# EAGLE schematic Orbit I_AnalougeEngine_V2_0 (EAGLE 9.1.0)

## Sheet 1 of 11: Interface
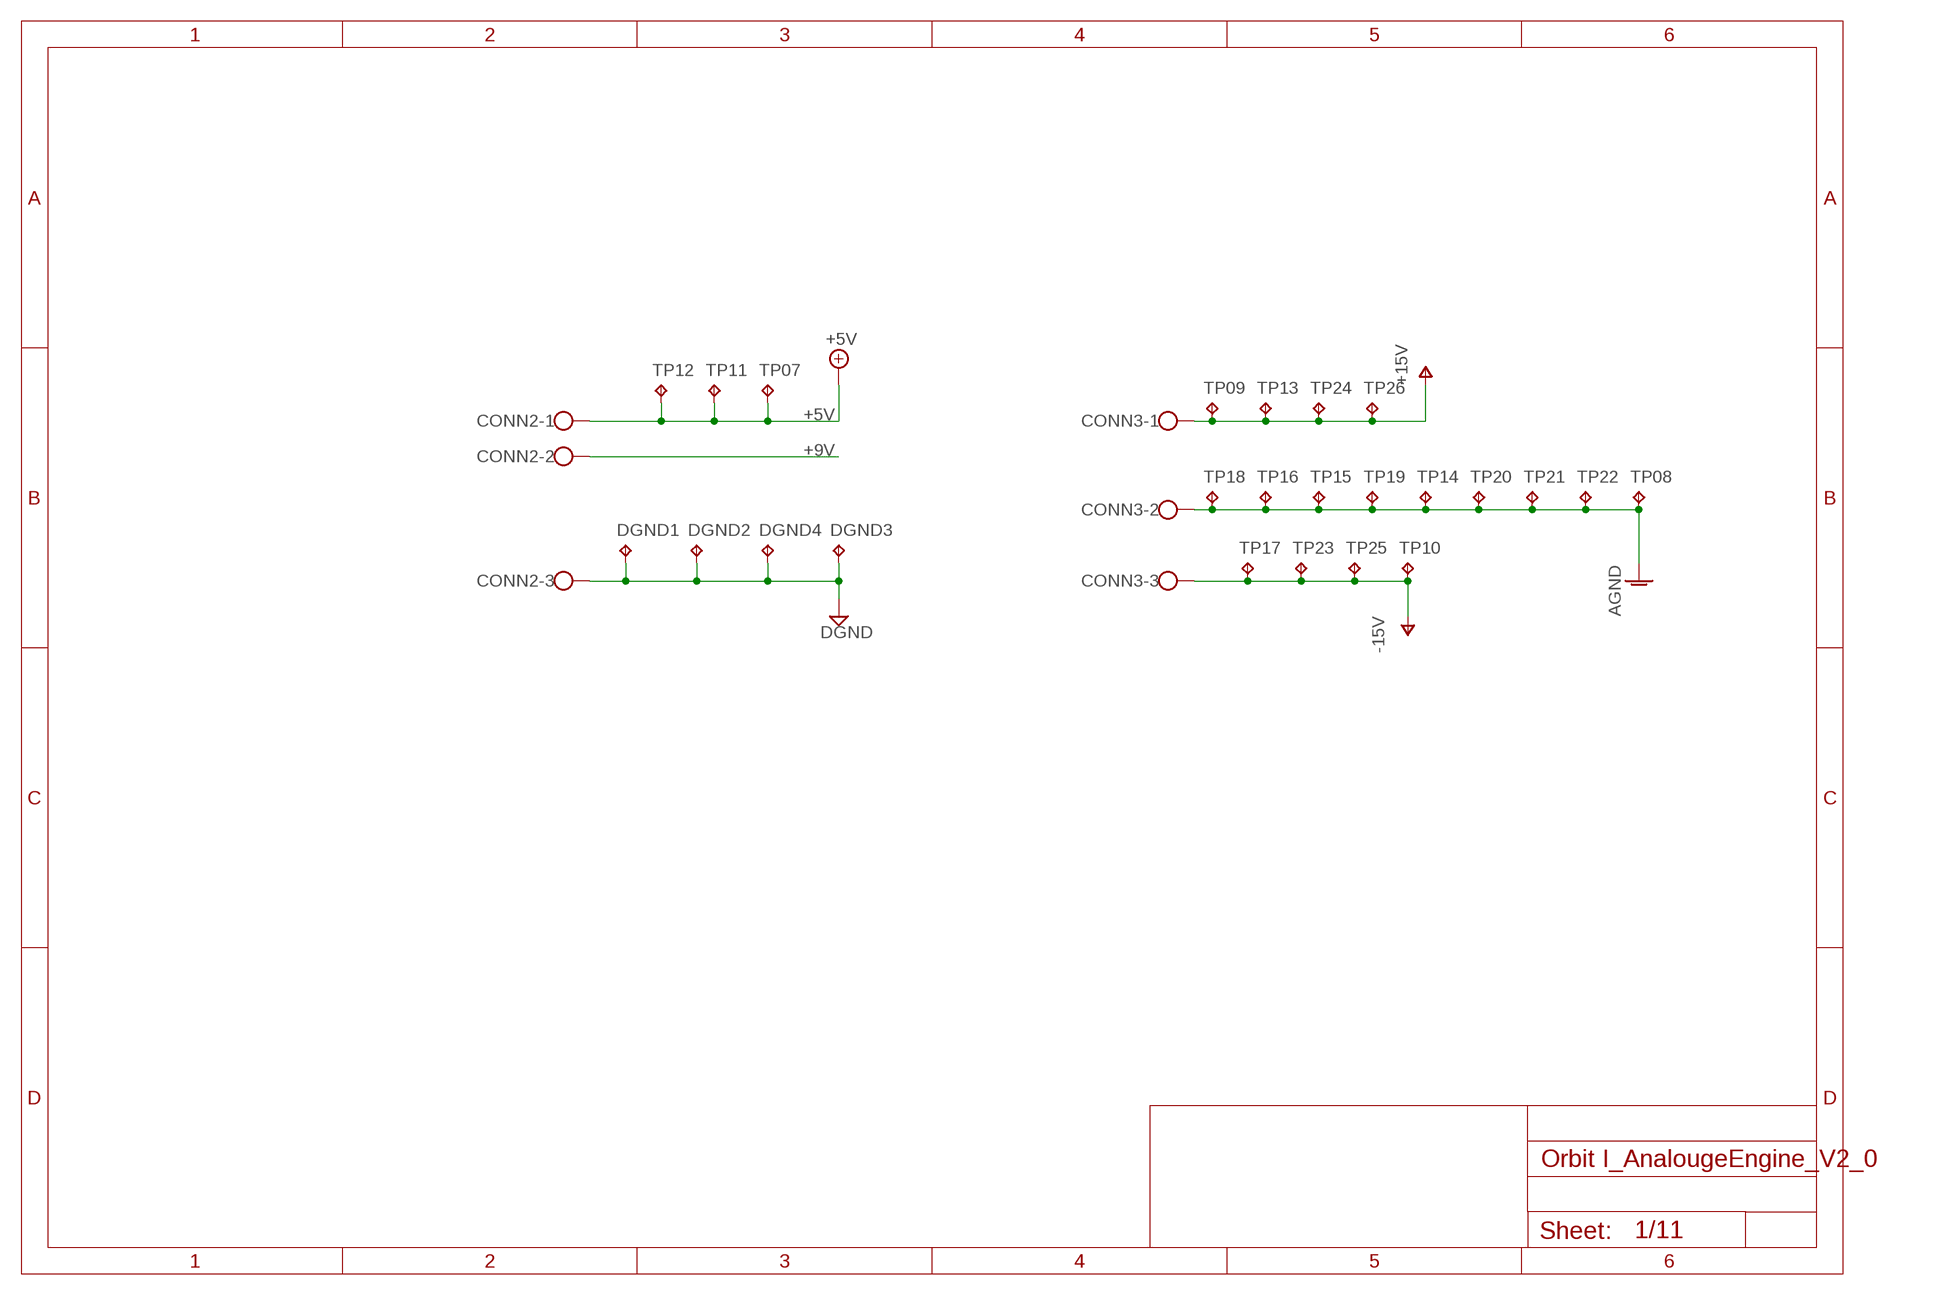
[diagram p0: schematic, sheet 1]

### Parts
CONN2  SCHRAUBKLEMME_3POL  [W237-103]
CONN3  SCHRAUBKLEMME_3POL  [W237-103]
DGND1  TPTHT  [THT_PIN]
DGND2  TPTHT  [THT_PIN]
DGND3  TPTHT  [THT_PIN]
DGND4  TPTHT  [THT_PIN]
TP07  TPTHT  [THT_PIN]
TP08  TPTHT  [THT_PIN]
TP09  TPTHT  [THT_PIN]
TP10  TPTHT  [THT_PIN]
TP11  TPTHT  [THT_PIN]
TP12  TPTHT  [THT_PIN]
TP13  TPTHT  [THT_PIN]
TP14  TPTHT  [THT_PIN]
TP15  TPTHT  [THT_PIN]
TP16  TPTHT  [THT_PIN]
TP17  TPTHT  [THT_PIN]
TP18  TPTHT  [THT_PIN]
TP19  TPTHT  [THT_PIN]
TP20  TPTHT  [THT_PIN]
TP21  TPTHT  [THT_PIN]
TP22  TPTHT  [THT_PIN]
TP23  TPTHT  [THT_PIN]
TP24  TPTHT  [THT_PIN]
TP25  TPTHT  [THT_PIN]
TP26  TPTHT  [THT_PIN]

### Nets
+5V: CONN2.1 TP07.P$1(TP) TP11.P$1(TP) TP12.P$1(TP) ; also sheet 2,8,9,10
+9V: CONN2.2
AGND: CONN3.2 TP08.P$1(TP) TP14.P$1(TP) TP15.P$1(TP) TP16.P$1(TP) TP18.P$1(TP) TP19.P$1(TP) TP20.P$1(TP) TP21.P$1(TP) TP22.P$1(TP) ; also sheet 3,4,5,6,7,8,11
DGND: CONN2.3 DGND1.P$1(TP) DGND2.P$1(TP) DGND3.P$1(TP) DGND4.P$1(TP) ; also sheet 2,8,9,10
V+: CONN3.1 TP09.P$1(TP) TP13.P$1(TP) TP24.P$1(TP) TP26.P$1(TP) ; supply symbol labelled +15V ; also sheet 3,4,5,6,7,8,11
V-: CONN3.3 TP10.P$1(TP) TP17.P$1(TP) TP23.P$1(TP) TP25.P$1(TP) ; supply symbol labelled -15V ; also sheet 3,4,5,6,7,11

## Sheet 2 of 11: Relais
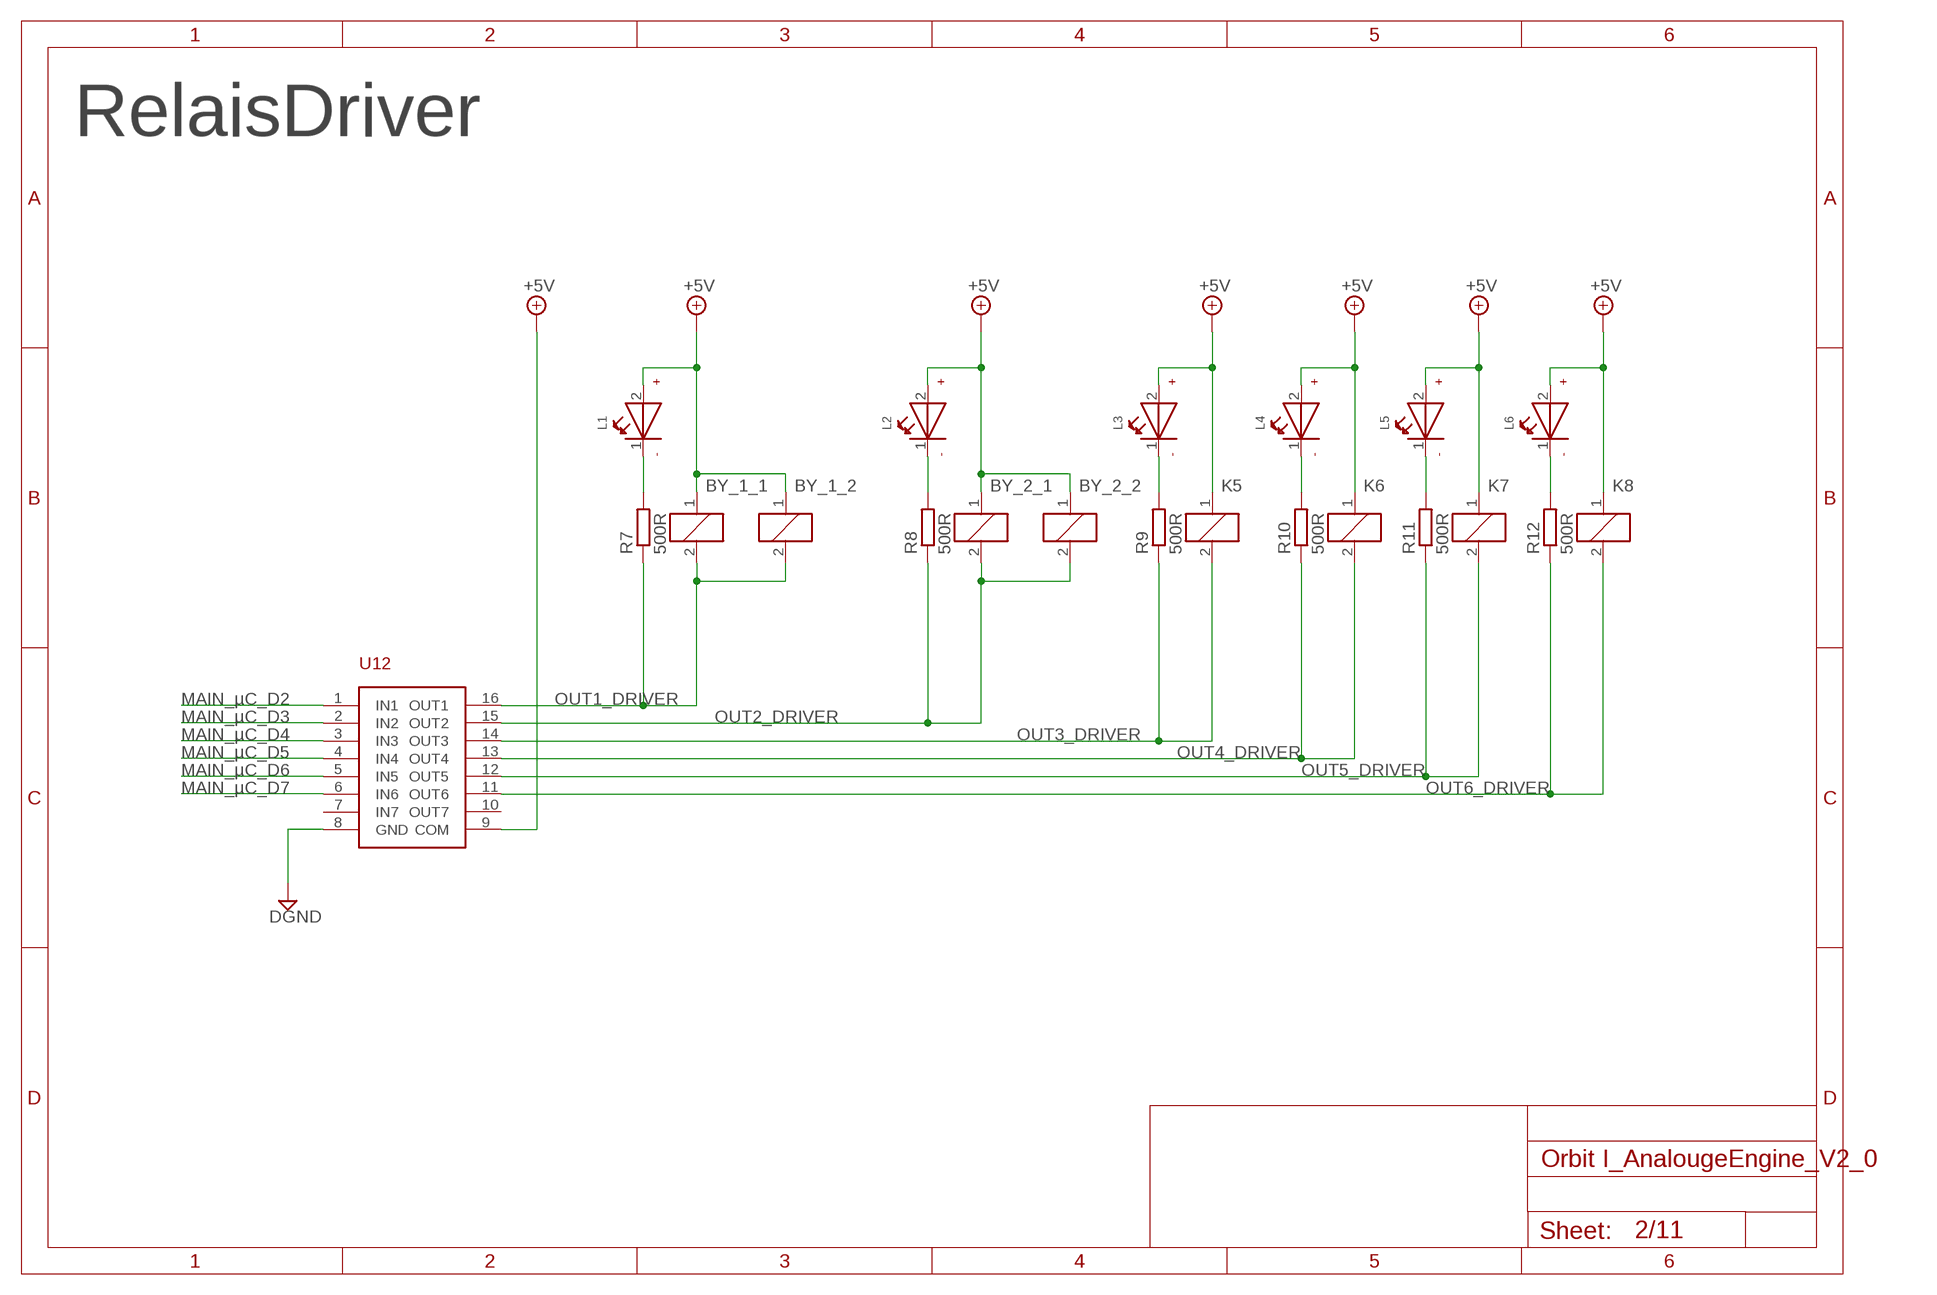
[diagram p1: schematic, sheet 2]

### Parts
BY_1_1  RELAY_EE2-5NU  [351]
BY_1_2  RELAY_EE2-5NU  [351]
BY_2_1  RELAY_EE2-5NU  [351]
BY_2_2  RELAY_EE2-5NU  [351]
K5  RELAY_EE2-5NU  [351]
K6  RELAY_EE2-5NU  [351]
K7  RELAY_EE2-5NU  [351]
K8  RELAY_EE2-5NU  [351]
L1  SMD_LED_0603  [WL-SMCW_0603]
L2  SMD_LED_0603  [WL-SMCW_0603]
L3  SMD_LED_0603  [WL-SMCW_0603]
L4  SMD_LED_0603  [WL-SMCW_0603]
L5  SMD_LED_0603  [WL-SMCW_0603]
L6  SMD_LED_0603  [WL-SMCW_0603]
R7  500R  RESISTOR"  [R0805]
R8  500R  RESISTOR"  [R0805]
R9  500R  RESISTOR"  [R0805]
R10  500R  RESISTOR"  [R0805]
R11  500R  RESISTOR"  [R0805]
R12  500R  RESISTOR"  [R0805]
U12  ULN2003  [SOIC16]

### Nets
+5V: BY_1_1.1 BY_1_2.1 BY_2_1.1 BY_2_2.1 K5.1 K6.1 K7.1 K8.1 L1.2(+) L2.2(+) L3.2(+) L4.2(+) L5.2(+) L6.2(+) U12.9(COM) ; also sheet 1,8,9,10
DGND: U12.8(GND) ; also sheet 1,8,9,10
MAIN_µC_D2: U12.1(IN1) ; also sheet 10
MAIN_µC_D3: U12.2(IN2) ; also sheet 10
MAIN_µC_D4: U12.3(IN3) ; also sheet 10
MAIN_µC_D5: U12.4(IN4) ; also sheet 10
MAIN_µC_D6: U12.5(IN5) ; also sheet 10
MAIN_µC_D7: U12.6(IN6) ; also sheet 10
N$14: L1.1(-) R7.2
N$16: L2.1(-) R8.2
N$26: L6.1(-) R12.2
N$29: L5.1(-) R11.2
N$30: L4.1(-) R10.2
N$32: L3.1(-) R9.2
OUT1_DRIVER: BY_1_1.2 BY_1_2.2 R7.1 U12.16(OUT1)
OUT2_DRIVER: BY_2_1.2 BY_2_2.2 R8.1 U12.15(OUT2)
OUT3_DRIVER: K5.2 R9.1 U12.14(OUT3)
OUT4_DRIVER: K6.2 R10.1 U12.13(OUT4)
OUT5_DRIVER: K7.2 R11.1 U12.12(OUT5)
OUT6_DRIVER: K8.2 R12.1 U12.11(OUT6)
Unconnected: U12.7(IN7) U12.10(OUT7)

### Notes on the sheet
- RelaisDriver

## Sheet 3 of 11: Right I/O Section
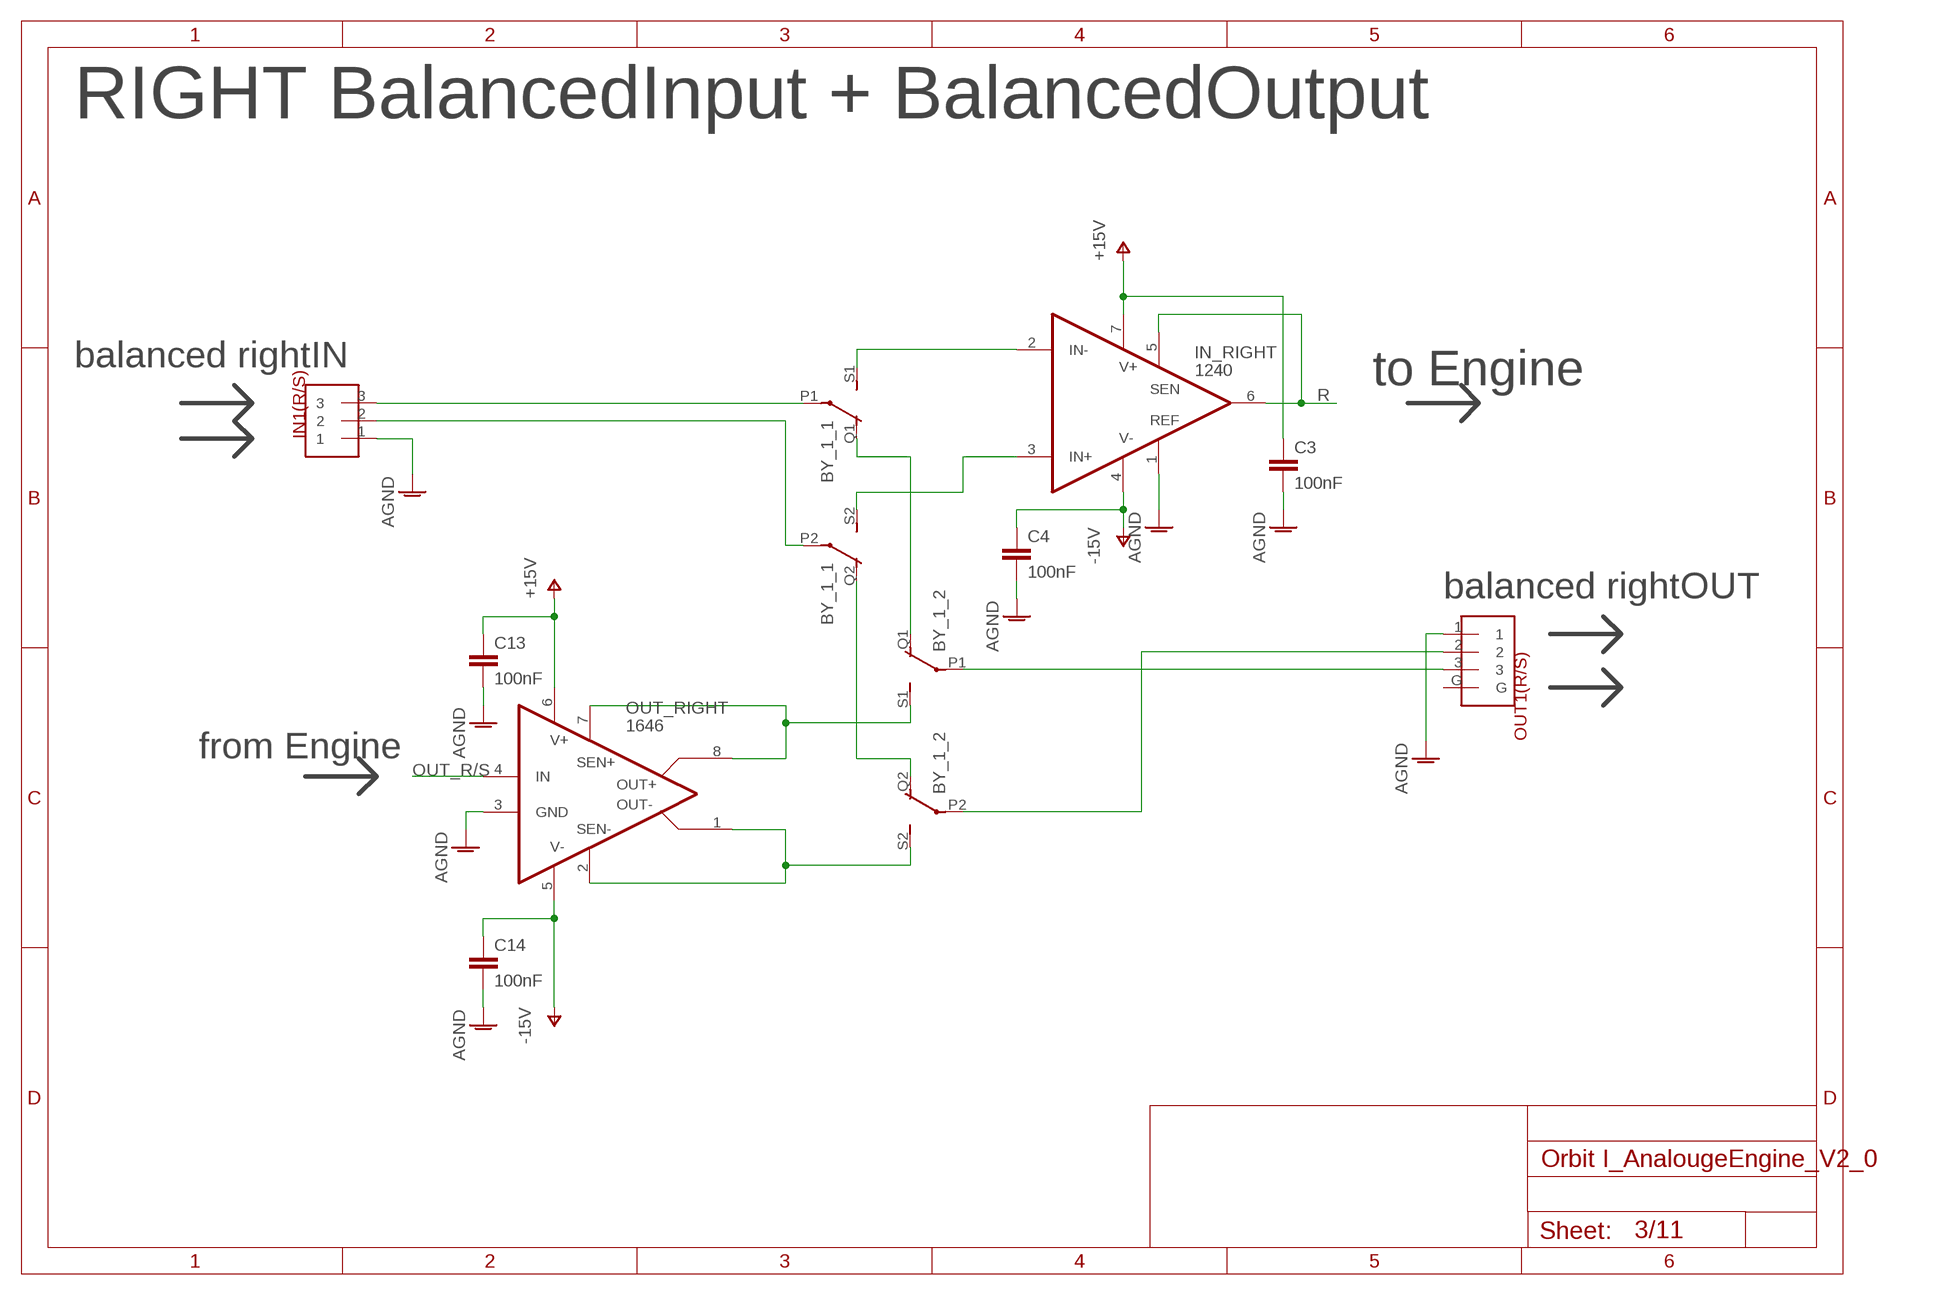
[diagram p2: schematic, sheet 3]

### Parts
C3  100nF  CAPACITOR"  [C0603]
C4  100nF  CAPACITOR"  [C0603]
C13  100nF  CAPACITOR"  [C0603]
C14  100nF  CAPACITOR"  [C0603]
IN1(R/S)  NEUTRIK_NC3FAH  [NEUTRIK_NC3FAH]
IN_RIGHT  1240  THAT1240SO8-U  [SO08]
OUT1(R/S)  NEUTRIK_NC3MAH  [NEUTRIK_NC3MAH]
OUT_RIGHT  1646  THAT1646SO8-U  [SO08]

### Nets
AGND: C3.2 C4.2 C13.2 C14.2 IN1(R/S).1 IN_RIGHT.1(REF) OUT1(R/S).1 OUT_RIGHT.3(GND) ; also sheet 1,4,5,6,7,8,11
N$1: BY_1_1.S1(2:S) IN_RIGHT.2(IN-)
N$2: BY_1_1.S2(3:S) IN_RIGHT.3(IN+)
N$8: BY_1_1.Q1(2:O) BY_1_2.Q1(2:O)
N$11: BY_1_1.Q2(3:O) BY_1_2.Q2(3:O)
N$21: BY_1_1.P2(3:P) IN1(R/S).2
N$22: BY_1_1.P1(2:P) IN1(R/S).3
N$23: BY_1_2.P2(3:P) OUT1(R/S).2
N$24: BY_1_2.P1(2:P) OUT1(R/S).3
OUT_R/S: OUT_RIGHT.4(IN) ; also sheet 7
R: IN_RIGHT.5(SEN) IN_RIGHT.6(OUT) ; also sheet 5,11
R/S_OUT+: BY_1_2.S1(2:S) OUT_RIGHT.7(SEN+) OUT_RIGHT.8(OUT+)
R/S_OUT-: BY_1_2.S2(3:S) OUT_RIGHT.1(OUT-) OUT_RIGHT.2(SEN-)
V+: C3.1 C13.1 IN_RIGHT.7(V+) OUT_RIGHT.6(V+) ; supply symbol labelled +15V ; also sheet 1,4,5,6,7,8,11
V-: C4.1 C14.1 IN_RIGHT.4(V-) OUT_RIGHT.5(V-) ; supply symbol labelled -15V ; also sheet 1,4,5,6,7,11
Unconnected: OUT1(R/S).G

### Notes on the sheet
- RIGHT BalancedInput + BalancedOutput
- balanced rightIN
- to Engine
- balanced rightOUT
- from Engine

## Sheet 4 of 11: Left I/O Section
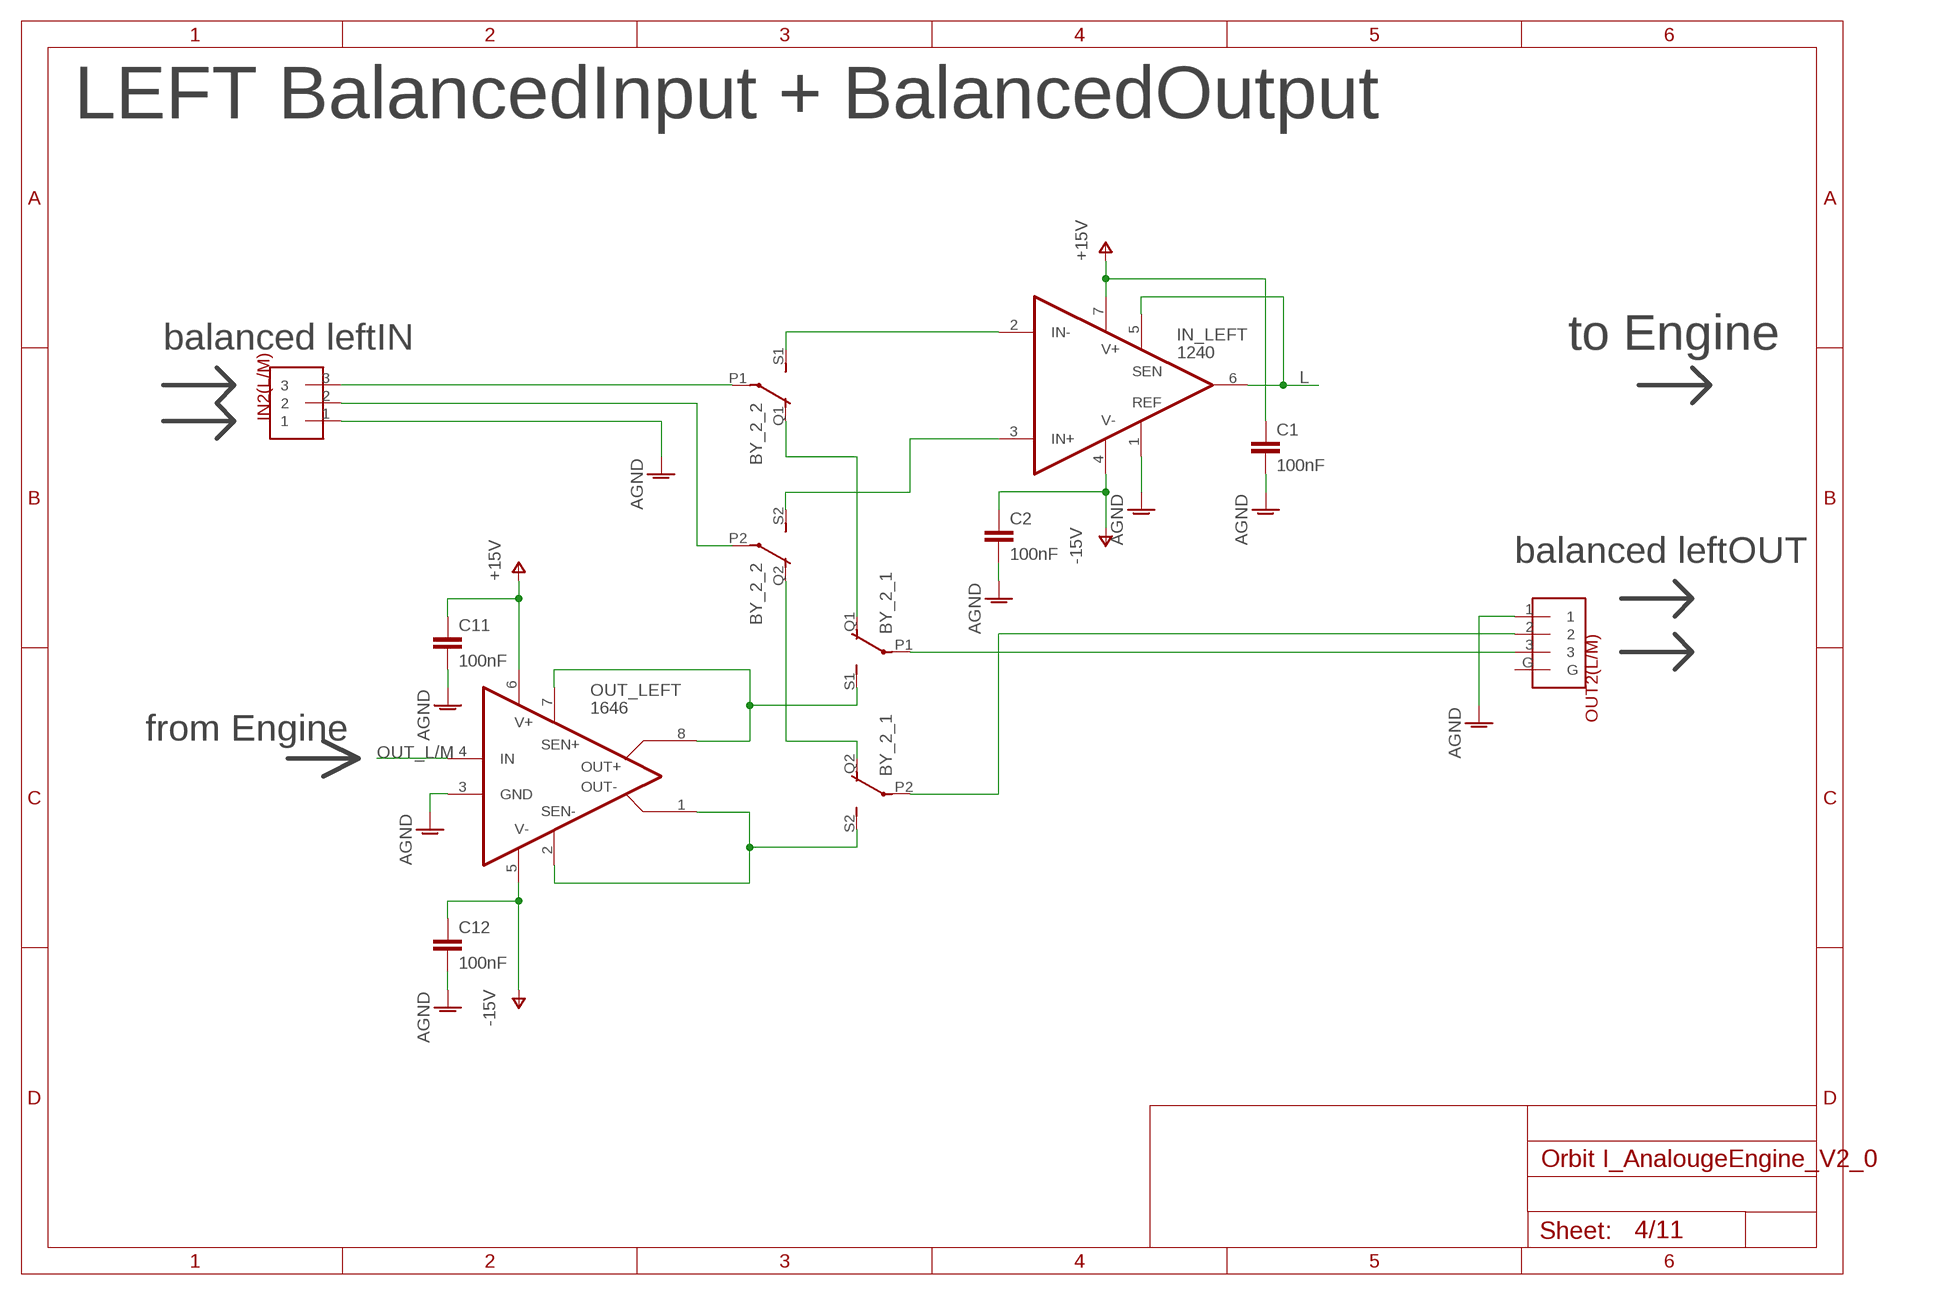
[diagram p3: schematic, sheet 4]

### Parts
C1  100nF  CAPACITOR"  [C0603]
C2  100nF  CAPACITOR"  [C0603]
C11  100nF  CAPACITOR"  [C0603]
C12  100nF  CAPACITOR"  [C0603]
IN2(L/M)  NEUTRIK_NC3FAH  [NEUTRIK_NC3FAH]
IN_LEFT  1240  THAT1240SO8-U  [SO08]
OUT2(L/M)  NEUTRIK_NC3MAH  [NEUTRIK_NC3MAH]
OUT_LEFT  1646  THAT1646SO8-U  [SO08]

### Nets
AGND: C1.2 C2.2 C11.2 C12.2 IN2(L/M).1 IN_LEFT.1(REF) OUT2(L/M).1 OUT_LEFT.3(GND) ; also sheet 1,3,5,6,7,8,11
L: IN_LEFT.5(SEN) IN_LEFT.6(OUT) ; also sheet 5,11
L/M_OUT+: BY_2_1.S1(2:S) OUT_LEFT.7(SEN+) OUT_LEFT.8(OUT+)
L/M_OUT-: BY_2_1.S2(3:S) OUT_LEFT.1(OUT-) OUT_LEFT.2(SEN-)
N$7: BY_2_2.S2(3:S) IN_LEFT.3(IN+)
N$13: BY_2_2.S1(2:S) IN_LEFT.2(IN-)
N$15: BY_2_1.P1(2:P) OUT2(L/M).3
N$17: BY_2_1.P2(3:P) OUT2(L/M).2
N$25: BY_2_2.P1(2:P) IN2(L/M).3
N$27: BY_2_2.P2(3:P) IN2(L/M).2
N$28: BY_2_1.Q1(2:O) BY_2_2.Q1(2:O)
N$31: BY_2_1.Q2(3:O) BY_2_2.Q2(3:O)
OUT_L/M: OUT_LEFT.4(IN) ; also sheet 7
V+: C1.1 C11.1 IN_LEFT.7(V+) OUT_LEFT.6(V+) ; supply symbol labelled +15V ; also sheet 1,3,5,6,7,8,11
V-: C2.1 C12.1 IN_LEFT.4(V-) OUT_LEFT.5(V-) ; supply symbol labelled -15V ; also sheet 1,3,5,6,7,11
Unconnected: OUT2(L/M).G

### Notes on the sheet
- LEFT BalancedInput + BalancedOutput
- balanced leftIN | to Engine
- balanced leftOUT
- from Engine

## Sheet 5 of 11: MS Encode
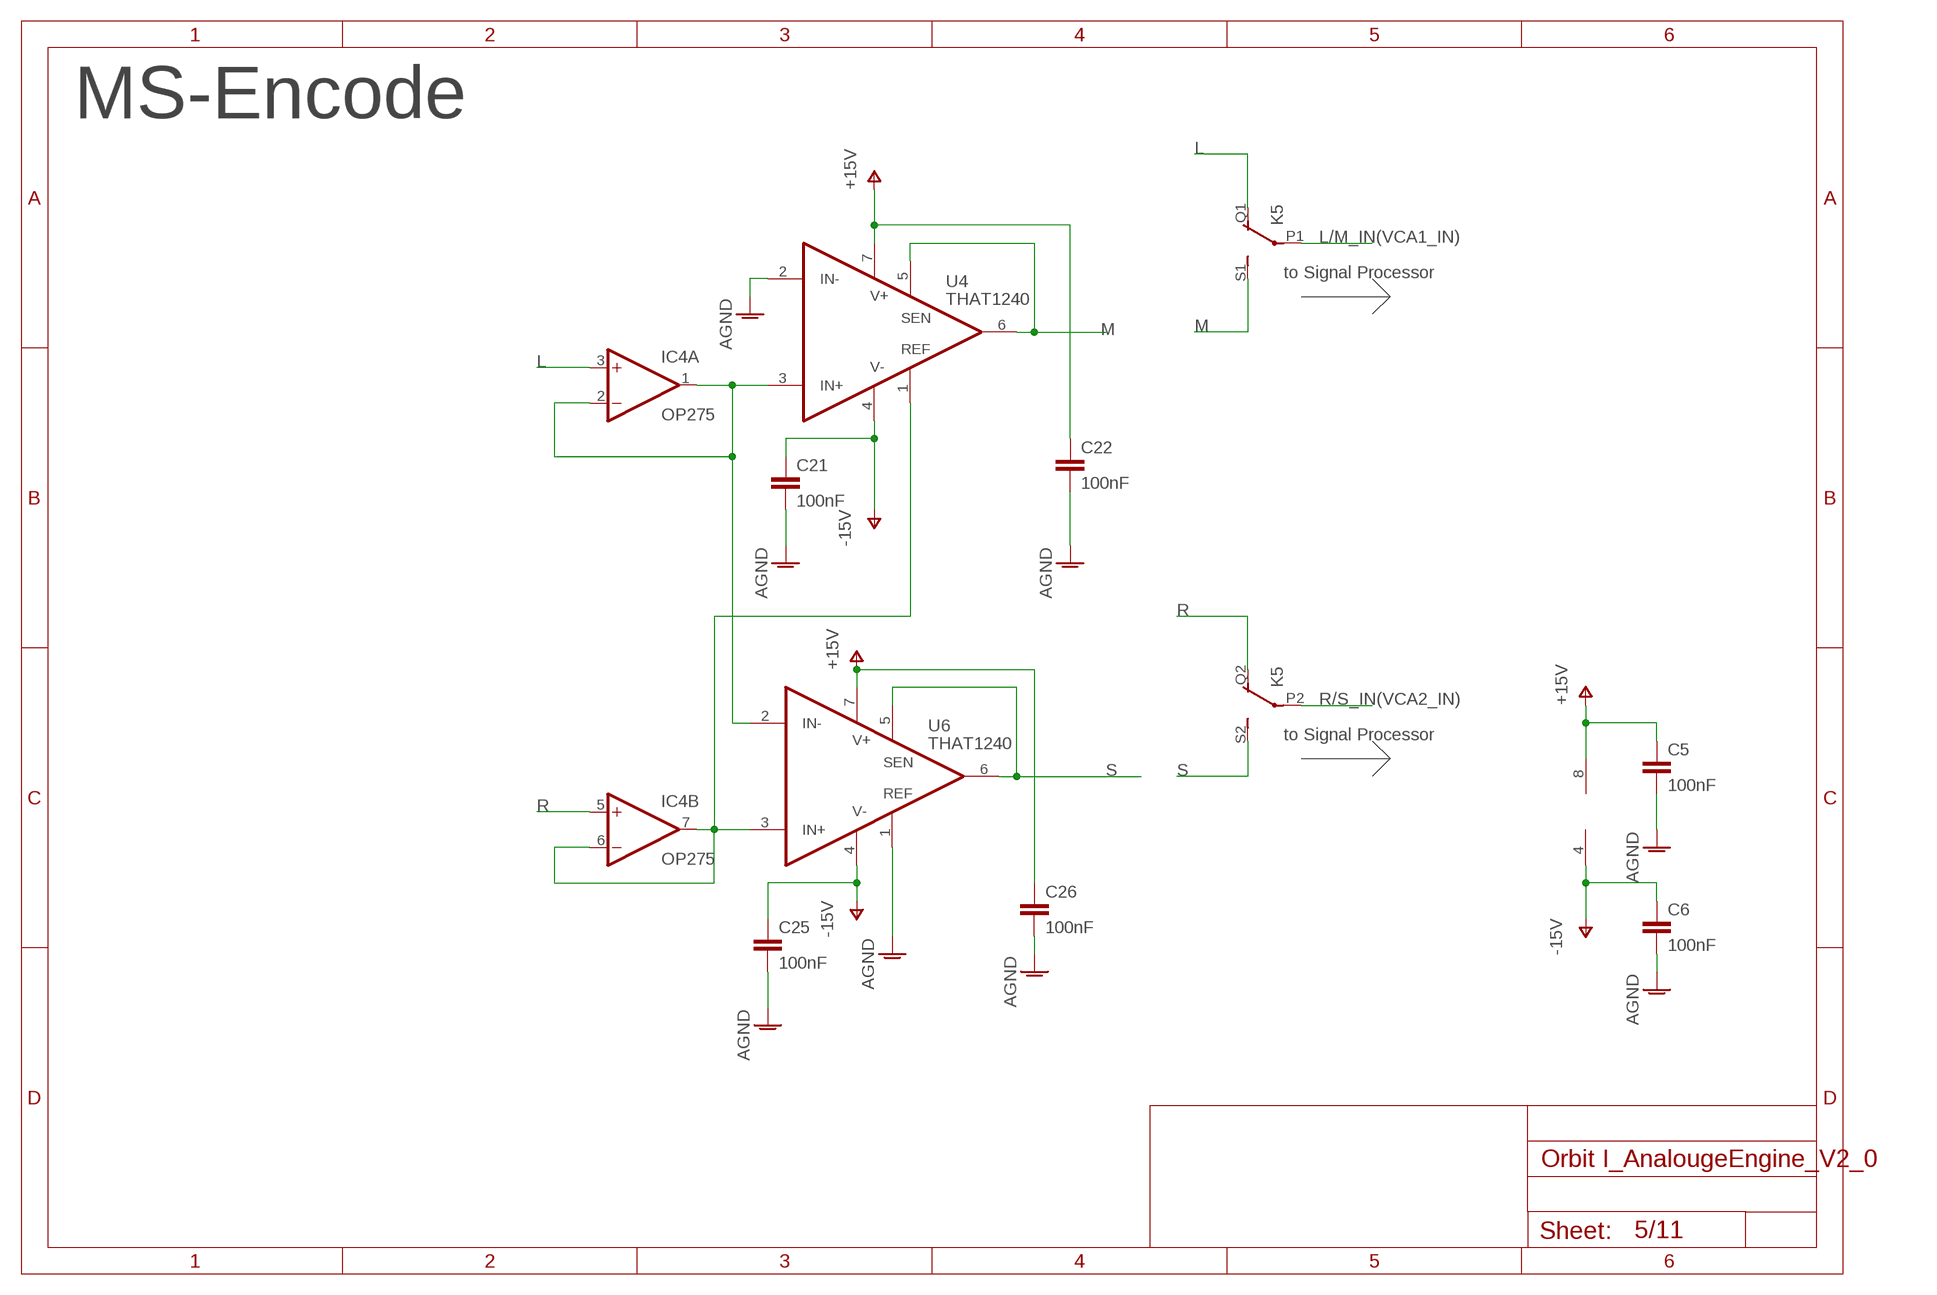
[diagram p4: schematic, sheet 5]

### Parts
C5  100nF  CAPACITOR"  [C0603]
C6  100nF  CAPACITOR"  [C0603]
C21  100nF  CAPACITOR"  [C0603]
C22  100nF  CAPACITOR"  [C0603]
C25  100nF  CAPACITOR"  [C0603]
C26  100nF  CAPACITOR"  [C0603]
IC4  OP275  [SOIC8]
U4  THAT1240  THAT1240SO8-U  [SO08]
U6  THAT1240  THAT1240SO8-U  [SO08]

### Nets
AGND: C5.2 C6.2 C21.2 C22.2 C25.2 C26.2 U4.2(IN-) U6.1(REF) ; also sheet 1,3,4,6,7,8,11
L: IC4.3(A:+IN) K5.Q1(2:O) ; also sheet 4,11
L/M_IN(VCA1_IN): K5.P1(2:P) ; also sheet 6
M: K5.S1(2:S) U4.5(SEN) U4.6(OUT) ; also sheet 11
N$18: IC4.1(A:OUT) IC4.2(A:-IN) U4.3(IN+) U6.2(IN-)
N$33: IC4.6(B:-IN) IC4.7(B:OUT) U4.1(REF) U6.3(IN+)
R: IC4.5(B:+IN) K5.Q2(3:O) ; also sheet 3,11
R/S_IN(VCA2_IN): K5.P2(3:P) ; also sheet 6
S: K5.S2(3:S) U6.5(SEN) U6.6(OUT) ; also sheet 11
V+: C5.1 C22.1 C26.1 IC4.8(P:V+) U4.7(V+) U6.7(V+) ; supply symbol labelled +15V ; also sheet 1,3,4,6,7,8,11
V-: C6.1 C21.1 C25.1 IC4.4(P:V-) U4.4(V-) U6.4(V-) ; supply symbol labelled -15V ; also sheet 1,3,4,6,7,11

### Notes on the sheet
- MS-Encode
- to Signal Processor
- to Signal Processor

## Sheet 6 of 11: VCA
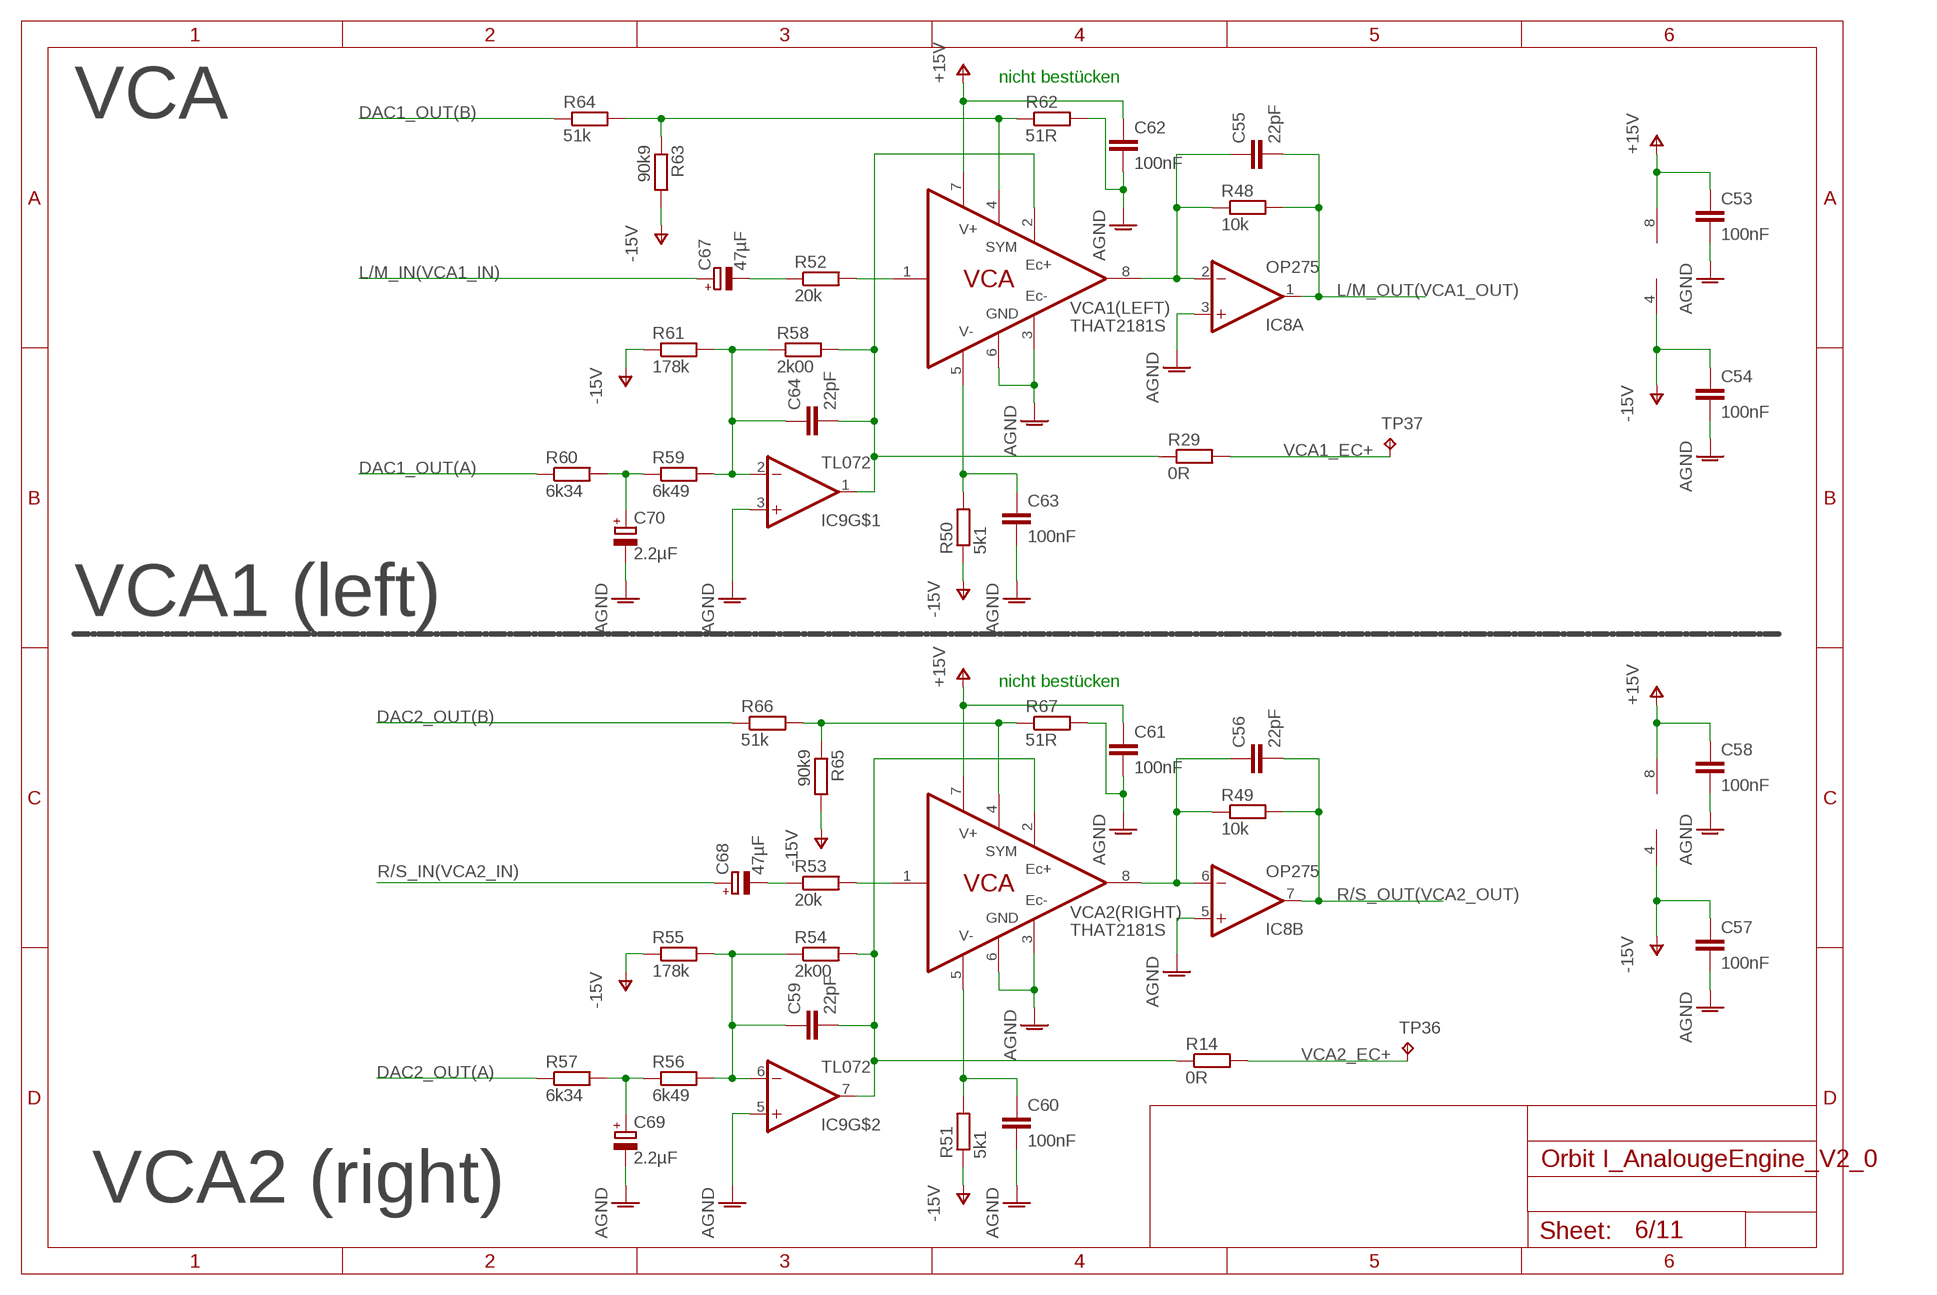
[diagram p5: schematic, sheet 6]

### Parts
C53  100nF  CAPACITOR"  [C0603]
C54  100nF  CAPACITOR"  [C0603]
C55  22pF  CAPACITOR"  [C0603]
C56  22pF  CAPACITOR"  [C0603]
C57  100nF  CAPACITOR"  [C0603]
C58  100nF  CAPACITOR"  [C0603]
C59  22pF  CAPACITOR"  [C0603]
C60  100nF  CAPACITOR"  [C0603]
C61  100nF  CAPACITOR"  [C0603]
C62  100nF  CAPACITOR"  [C0603]
C63  100nF  CAPACITOR"  [C0603]
C64  22pF  CAPACITOR"  [C0603]
C67  47µF  SMD_ELCTROLYTIC  [153CLV-0605]
C68  47µF  SMD_ELCTROLYTIC  [153CLV-0605]
C69  2.2µF  SMD_ELCTROLYTIC  [153CLV-0605]
C70  2.2µF  SMD_ELCTROLYTIC  [153CLV-0605]
IC8  OP275  [SOIC8]
IC9  TL072  [SOIC8]
R14  0R  RESISTOR"  [R0805]
R29  0R  RESISTOR"  [R0805]
R48  10k  RESISTOR"  [R0805]
R49  10k  RESISTOR"  [R0805]
R50  5k1  RESISTOR"  [R0805]
R51  5k1  RESISTOR"  [R0805]
R52  20k  RESISTOR"  [R0805]
R53  20k  RESISTOR"  [R0805]
R54  2k00  RESISTOR"  [R0805]
R55  178k  RESISTOR"  [R0805]
R56  6k49  RESISTOR"  [R0805]
R57  6k34  RESISTOR"  [R0805]
R58  2k00  RESISTOR"  [R0805]
R59  6k49  RESISTOR"  [R0805]
R60  6k34  RESISTOR"  [R0805]
R61  178k  RESISTOR"  [R0805]
R62  51R  RESISTOR"  [R0805]
R63  90k9  RESISTOR"  [R0805]
R64  51k  RESISTOR"  [R0805]
R65  90k9  RESISTOR"  [R0805]
R66  51k  RESISTOR"  [R0805]
R67  51R  RESISTOR"  [R0805]
TP36  TPTHT  [THT_PIN]
TP37  TPTHT  [THT_PIN]
VCA1(LEFT)  THAT2181S  [SO08]
VCA2(RIGHT)  THAT2181S  [SO08]

### Nets
AGND: C53.2 C54.2 C57.2 C58.2 C60.2 C61.2 C62.2 C63.2 C69.- C70.- IC8.3(A:+IN) IC8.5(B:+IN) IC9.3(+IN) IC9.5(+IN) R62.2 R67.2 VCA1(LEFT).3(EC-) VCA1(LEFT).6(GND) VCA2(RIGHT).3(EC-) VCA2(RIGHT).6(GND) ; also sheet 1,3,4,5,7,8,11
DAC1_OUT(A): R60.1 ; also sheet 8
DAC1_OUT(B): R64.1 ; also sheet 8
DAC2_OUT(A): R57.1 ; also sheet 8
DAC2_OUT(B): R66.1 ; also sheet 8
L/M_IN(VCA1_IN): C67.+ ; also sheet 5
L/M_OUT(VCA1_OUT): C55.2 IC8.1(A:OUT) R48.2 ; also sheet 7,11
N$64: C55.1 IC8.2(A:-IN) R48.1 VCA1(LEFT).8(OUT)
N$65: R52.2 VCA1(LEFT).1(IN)
N$71: C67.- R52.1
N$72: C70.+ R59.1 R60.2
N$75: C56.1 IC8.6(B:-IN) R49.1 VCA2(RIGHT).8(OUT)
N$77: C60.1 R51.2 VCA2(RIGHT).5(V-)
N$78: C68.- R53.1
N$79: R53.2 VCA2(RIGHT).1(IN)
N$80: C63.1 R50.2 VCA1(LEFT).5(V-)
N$81: C59.1 IC9.6(-IN) R54.1 R55.2 R56.2
N$82: C59.2 IC9.7(OUT) R14.1 R54.2 VCA2(RIGHT).2(EC+)
N$84: C64.1 IC9.2(-IN) R58.1 R59.2 R61.2
N$85: C69.+ R56.1 R57.2
N$87: R62.1 R63.1 R64.2 VCA1(LEFT).4(SYM)
N$88: C64.2 IC9.1(OUT) R29.1 R58.2 VCA1(LEFT).2(EC+)
N$95: R65.1 R66.2 R67.1 VCA2(RIGHT).4(SYM)
R/S_IN(VCA2_IN): C68.+ ; also sheet 5
R/S_OUT(VCA2_OUT): C56.2 IC8.7(B:OUT) R49.2 ; also sheet 7,11
V+: C53.1 C58.1 C61.1 C62.1 IC8.8(P:V+) IC9.8(V+) VCA1(LEFT).7(V+) VCA2(RIGHT).7(V+) ; supply symbol labelled +15V ; also sheet 1,3,4,5,7,8,11
V-: C54.1 C57.1 IC8.4(P:V-) IC9.4(V-) R50.1 R51.1 R55.1 R61.1 R63.2 R65.2 ; supply symbol labelled -15V ; also sheet 1,3,4,5,7,11
VCA1_EC+: R29.2 TP37.P$1(TP) ; also sheet 10
VCA2_EC+: R14.2 TP36.P$1(TP) ; also sheet 10

### Notes on the sheet
- nicht bestücken
- VCA
- VCA1 (left)
- nicht bestücken
- VCA2 (right)

## Sheet 7 of 11: MS Decode
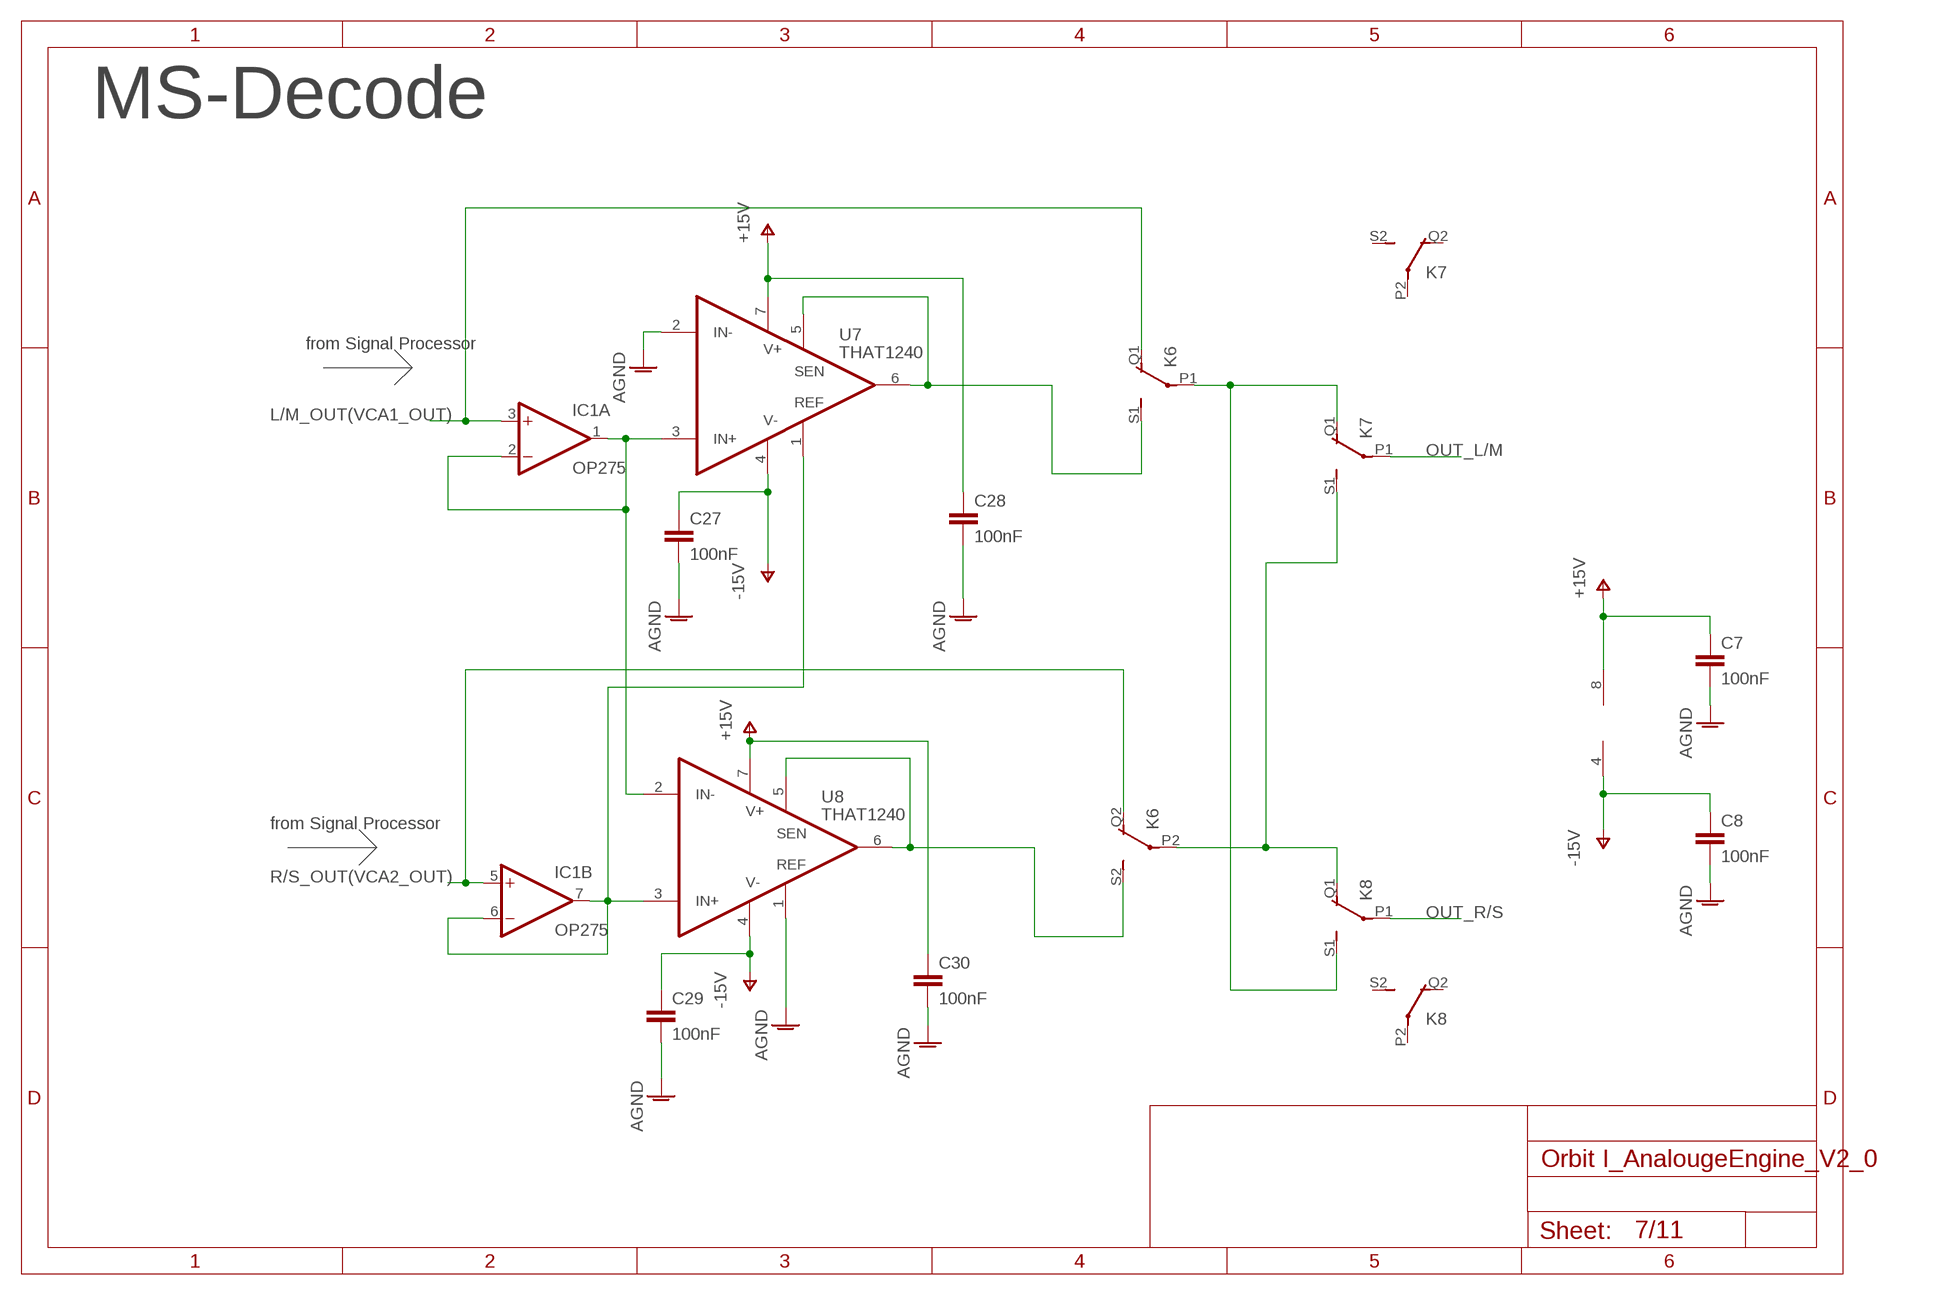
[diagram p6: schematic, sheet 7]

### Parts
C7  100nF  CAPACITOR"  [C0603]
C8  100nF  CAPACITOR"  [C0603]
C27  100nF  CAPACITOR"  [C0603]
C28  100nF  CAPACITOR"  [C0603]
C29  100nF  CAPACITOR"  [C0603]
C30  100nF  CAPACITOR"  [C0603]
IC1  OP275  [SOIC8]
U7  THAT1240  THAT1240SO8-U  [SO08]
U8  THAT1240  THAT1240SO8-U  [SO08]

### Nets
AGND: C7.2 C8.2 C27.2 C28.2 C29.2 C30.2 U7.2(IN-) U8.1(REF) ; also sheet 1,3,4,5,6,8,11
L/M_OUT(VCA1_OUT): IC1.3(A:+IN) K6.Q1(2:O) ; also sheet 6,11
M1: K6.S1(2:S) U7.5(SEN) U7.6(OUT)
N$5: K6.P1(2:P) K7.Q1(2:O) K8.S1(2:S)
N$19: K6.P2(3:P) K7.S1(2:S) K8.Q1(2:O)
N$43: IC1.6(B:-IN) IC1.7(B:OUT) U7.1(REF) U8.3(IN+)
N$45: IC1.1(A:OUT) IC1.2(A:-IN) U7.3(IN+) U8.2(IN-)
OUT_L/M: K7.P1(2:P) ; also sheet 4
OUT_R/S: K8.P1(2:P) ; also sheet 3
R/S_OUT(VCA2_OUT): IC1.5(B:+IN) K6.Q2(3:O) ; also sheet 6,11
S1: K6.S2(3:S) U8.5(SEN) U8.6(OUT)
V+: C7.1 C28.1 C30.1 IC1.8(P:V+) U7.7(V+) U8.7(V+) ; supply symbol labelled +15V ; also sheet 1,3,4,5,6,8,11
V-: C8.1 C27.1 C29.1 IC1.4(P:V-) U7.4(V-) U8.4(V-) ; supply symbol labelled -15V ; also sheet 1,3,4,5,6,11
Unconnected: K7.P2(3:P) K7.Q2(3:O) K7.S2(3:S) K8.P2(3:P) K8.Q2(3:O) K8.S2(3:S)

### Notes on the sheet
- MS-Decode
- from Signal Processor
- from Signal Processor

## Sheet 8 of 11: VCA - Controller
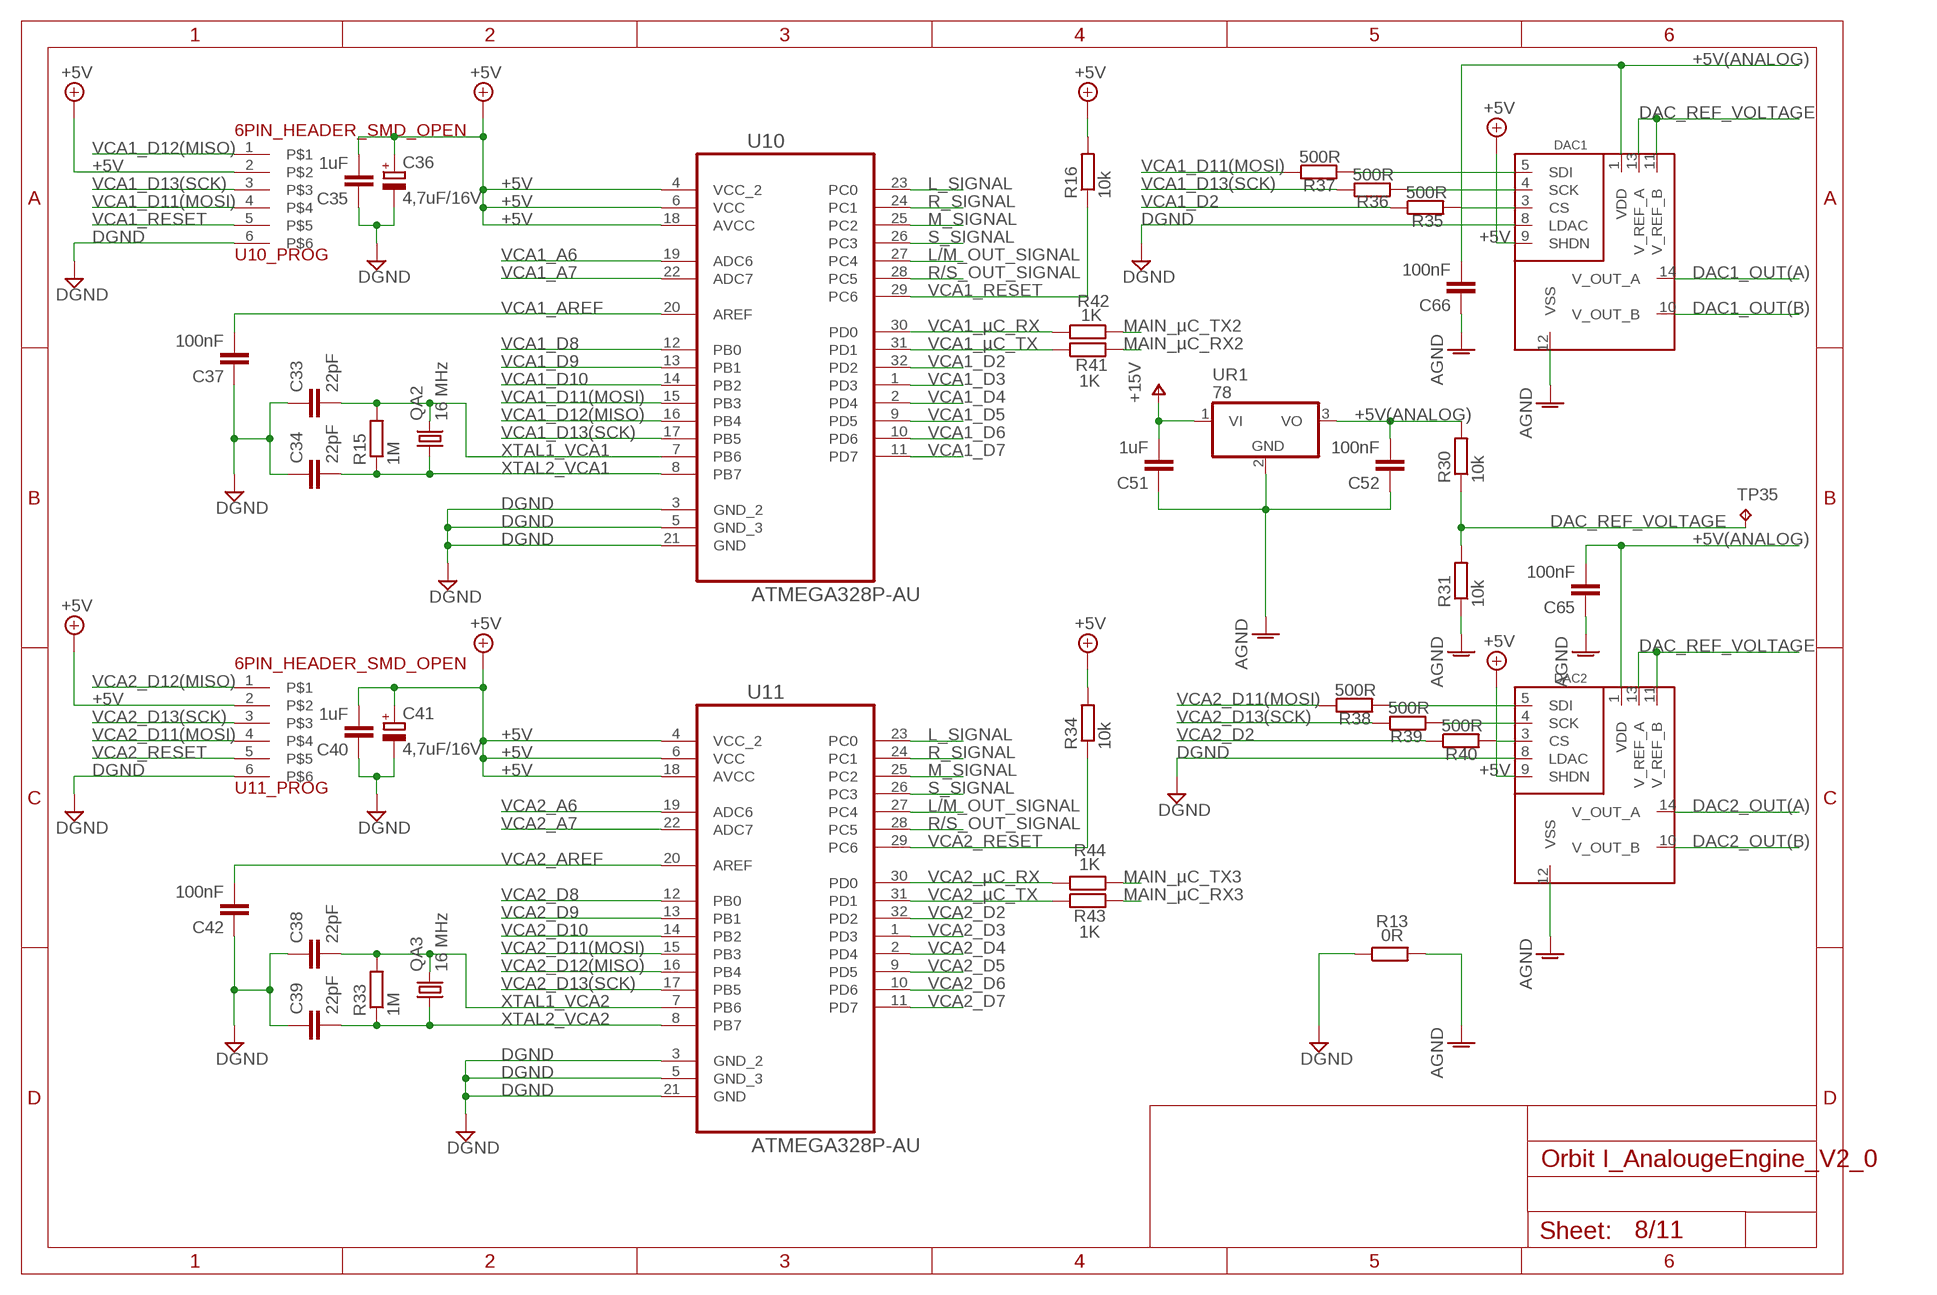
[diagram p7: schematic, sheet 8]

### Parts
C33  22pF  CAPACITOR"  [C0603]
C34  22pF  CAPACITOR"  [C0603]
C35  1uF  CAPACITOR"  [C0603]
C36  4,7uF/16V  SMD_ELCTROLYTIC  [153CLV-0605]
C37  100nF  CAPACITOR"  [C0603]
C38  22pF  CAPACITOR"  [C0603]
C39  22pF  CAPACITOR"  [C0603]
C40  1uF  CAPACITOR"  [C0603]
C41  4,7uF/16V  SMD_ELCTROLYTIC  [153CLV-0605]
C42  100nF  CAPACITOR"  [C0603]
C51  1uF  CAPACITOR"  [C0603]
C52  100nF  CAPACITOR"  [C0603]
C65  100nF  CAPACITOR"  [C0603]
C66  100nF  CAPACITOR"  [C0603]
DAC1  MCP4922  [SOIC16]
DAC2  MCP4922  [SOIC16]
QA2  16 MHz  CRYSTAL_SM49  [SM49]
QA3  16 MHz  CRYSTAL_SM49  [SM49]
R13  0R  RESISTOR"  [R0805]
R15  1M  RESISTOR"  [R0805]
R16  10k  RESISTOR"  [R0805]
R30  10k  RESISTOR"  [R0805]
R31  10k  RESISTOR"  [R0805]
R33  1M  RESISTOR"  [R0805]
R34  10k  RESISTOR"  [R0805]
R35  500R  RESISTOR"  [R0805]
R36  500R  RESISTOR"  [R0805]
R37  500R  RESISTOR"  [R0805]
R38  500R  RESISTOR"  [R0805]
R39  500R  RESISTOR"  [R0805]
R40  500R  RESISTOR"  [R0805]
R41  1K  RESISTOR"  [R0805]
R42  1K  RESISTOR"  [R0805]
R43  1K  RESISTOR"  [R0805]
R44  1K  RESISTOR"  [R0805]
TP35  TPTHT  [THT_PIN]
U10  ATMEGA328P-AU  [QFP80P900X900X120-32N]
U10_PROG  6PIN_HEADER_SMD_OPEN  [6PIN_HEADER_SMD_OPEN]
U11  ATMEGA328P-AU  [QFP80P900X900X120-32N]
U11_PROG  6PIN_HEADER_SMD_OPEN  [6PIN_HEADER_SMD_OPEN]
UR1  78  [TO252]

### Nets
+5V: C35.2 C36.+ C40.2 C41.+ DAC1.9(SHDN) DAC2.9(SHDN) R16.2 R34.2 U10.4(VCC_2) U10.6(VCC) U10.18(AVCC) U10_PROG.2 U11.4(VCC_2) U11.6(VCC) U11.18(AVCC) U11_PROG.2 ; also sheet 1,2,9,10
+5V(ANALOG): C52.2 C65.2 C66.2 DAC1.1(VDD) DAC2.1(VDD) R30.2 UR1.3(VO)
AGND: C51.1 C52.1 C65.1 C66.1 DAC1.12(VSS) DAC2.12(VSS) R13.2 R31.1 UR1.2(GND) ; also sheet 1,3,4,5,6,7,11
DAC1_OUT(A): DAC1.14(V_OUT_A) ; also sheet 6
DAC1_OUT(B): DAC1.10(V_OUT_B) ; also sheet 6
DAC2_OUT(A): DAC2.14(V_OUT_A) ; also sheet 6
DAC2_OUT(B): DAC2.10(V_OUT_B) ; also sheet 6
DAC_REF_VOLTAGE: DAC1.11(V_REF_B) DAC1.13(V_REF_A) DAC2.11(V_REF_B) DAC2.13(V_REF_A) R30.1 R31.2 TP35.P$1(TP)
DGND: C33.1 C34.1 C35.1 C36.- C37.1 C38.1 C39.1 C40.1 C41.- C42.1 DAC1.8(LDAC) DAC2.8(LDAC) R13.1 U10.3(GND_2) U10.5(GND_3) U10.21(GND) U10_PROG.6 U11.3(GND_2) U11.5(GND_3) U11.21(GND) U11_PROG.6 ; also sheet 1,2,9,10
L/M_OUT_SIGNAL: U10.27(PC4) U11.27(PC4) ; also sheet 10,11
L_SIGNAL: U10.23(PC0) U11.23(PC0) ; also sheet 10,11
M_SIGNAL: U10.25(PC2) U11.25(PC2) ; also sheet 10,11
MAIN_µC_RX2: R41.2 ; also sheet 10
MAIN_µC_RX3: R43.2 ; also sheet 10
MAIN_µC_TX2: R42.2 ; also sheet 10
MAIN_µC_TX3: R44.2 ; also sheet 10
N$36: DAC1.3(CS) R35.2
N$63: DAC1.4(SCK) R36.2
N$66: DAC1.5(SDI) R37.2
N$67: DAC2.3(CS) R40.2
N$68: DAC2.4(SCK) R39.2
N$69: DAC2.5(SDI) R38.2
R/S_OUT_SIGNAL: U10.28(PC5) U11.28(PC5) ; also sheet 10,11
R_SIGNAL: U10.24(PC1) U11.24(PC1) ; also sheet 10,11
S_SIGNAL: U10.26(PC3) U11.26(PC3) ; also sheet 10,11
V+: C51.2 UR1.1(VI) ; supply symbol labelled +15V ; also sheet 1,3,4,5,6,7,11
VCA1_A6: U10.19(ADC6)
VCA1_A7: U10.22(ADC7)
VCA1_AREF: C37.2 U10.20(AREF)
VCA1_D2: R35.1 U10.32(PD2)
VCA1_D3: U10.1(PD3)
VCA1_D4: U10.2(PD4)
VCA1_D5: U10.9(PD5)
VCA1_D6: U10.10(PD6)
VCA1_D7: U10.11(PD7)
VCA1_D8: U10.12(PB0)
VCA1_D9: U10.13(PB1)
VCA1_D10: U10.14(PB2)
VCA1_D11(MOSI): R37.1 U10.15(PB3) U10_PROG.4
VCA1_D12(MISO): U10.16(PB4) U10_PROG.1
VCA1_D13(SCK): R36.1 U10.17(PB5) U10_PROG.3
VCA1_RESET: R16.1 U10.29(PC6) U10_PROG.5
VCA1_µC_RX: R42.1 U10.30(PD0)
VCA1_µC_TX: R41.1 U10.31(PD1)
VCA2_A6: U11.19(ADC6)
VCA2_A7: U11.22(ADC7)
VCA2_AREF: C42.2 U11.20(AREF)
VCA2_D2: R40.1 U11.32(PD2)
VCA2_D3: U11.1(PD3)
VCA2_D4: U11.2(PD4)
VCA2_D5: U11.9(PD5)
VCA2_D6: U11.10(PD6)
VCA2_D7: U11.11(PD7)
VCA2_D8: U11.12(PB0)
VCA2_D9: U11.13(PB1)
VCA2_D10: U11.14(PB2)
VCA2_D11(MOSI): R38.1 U11.15(PB3) U11_PROG.4
VCA2_D12(MISO): U11.16(PB4) U11_PROG.1
VCA2_D13(SCK): R39.1 U11.17(PB5) U11_PROG.3
VCA2_RESET: R34.1 U11.29(PC6) U11_PROG.5
VCA2_µC_RX: R44.1 U11.30(PD0)
VCA2_µC_TX: R43.1 U11.31(PD1)
XTAL1_VCA1: C33.2 QA2.2 R15.2 U10.7(PB6)
XTAL1_VCA2: C38.2 QA3.2 R33.2 U11.7(PB6)
XTAL2_VCA1: C34.2 QA2.1 R15.1 U10.8(PB7)
XTAL2_VCA2: C39.2 QA3.1 R33.1 U11.8(PB7)

## Sheet 9 of 11: USB Interface
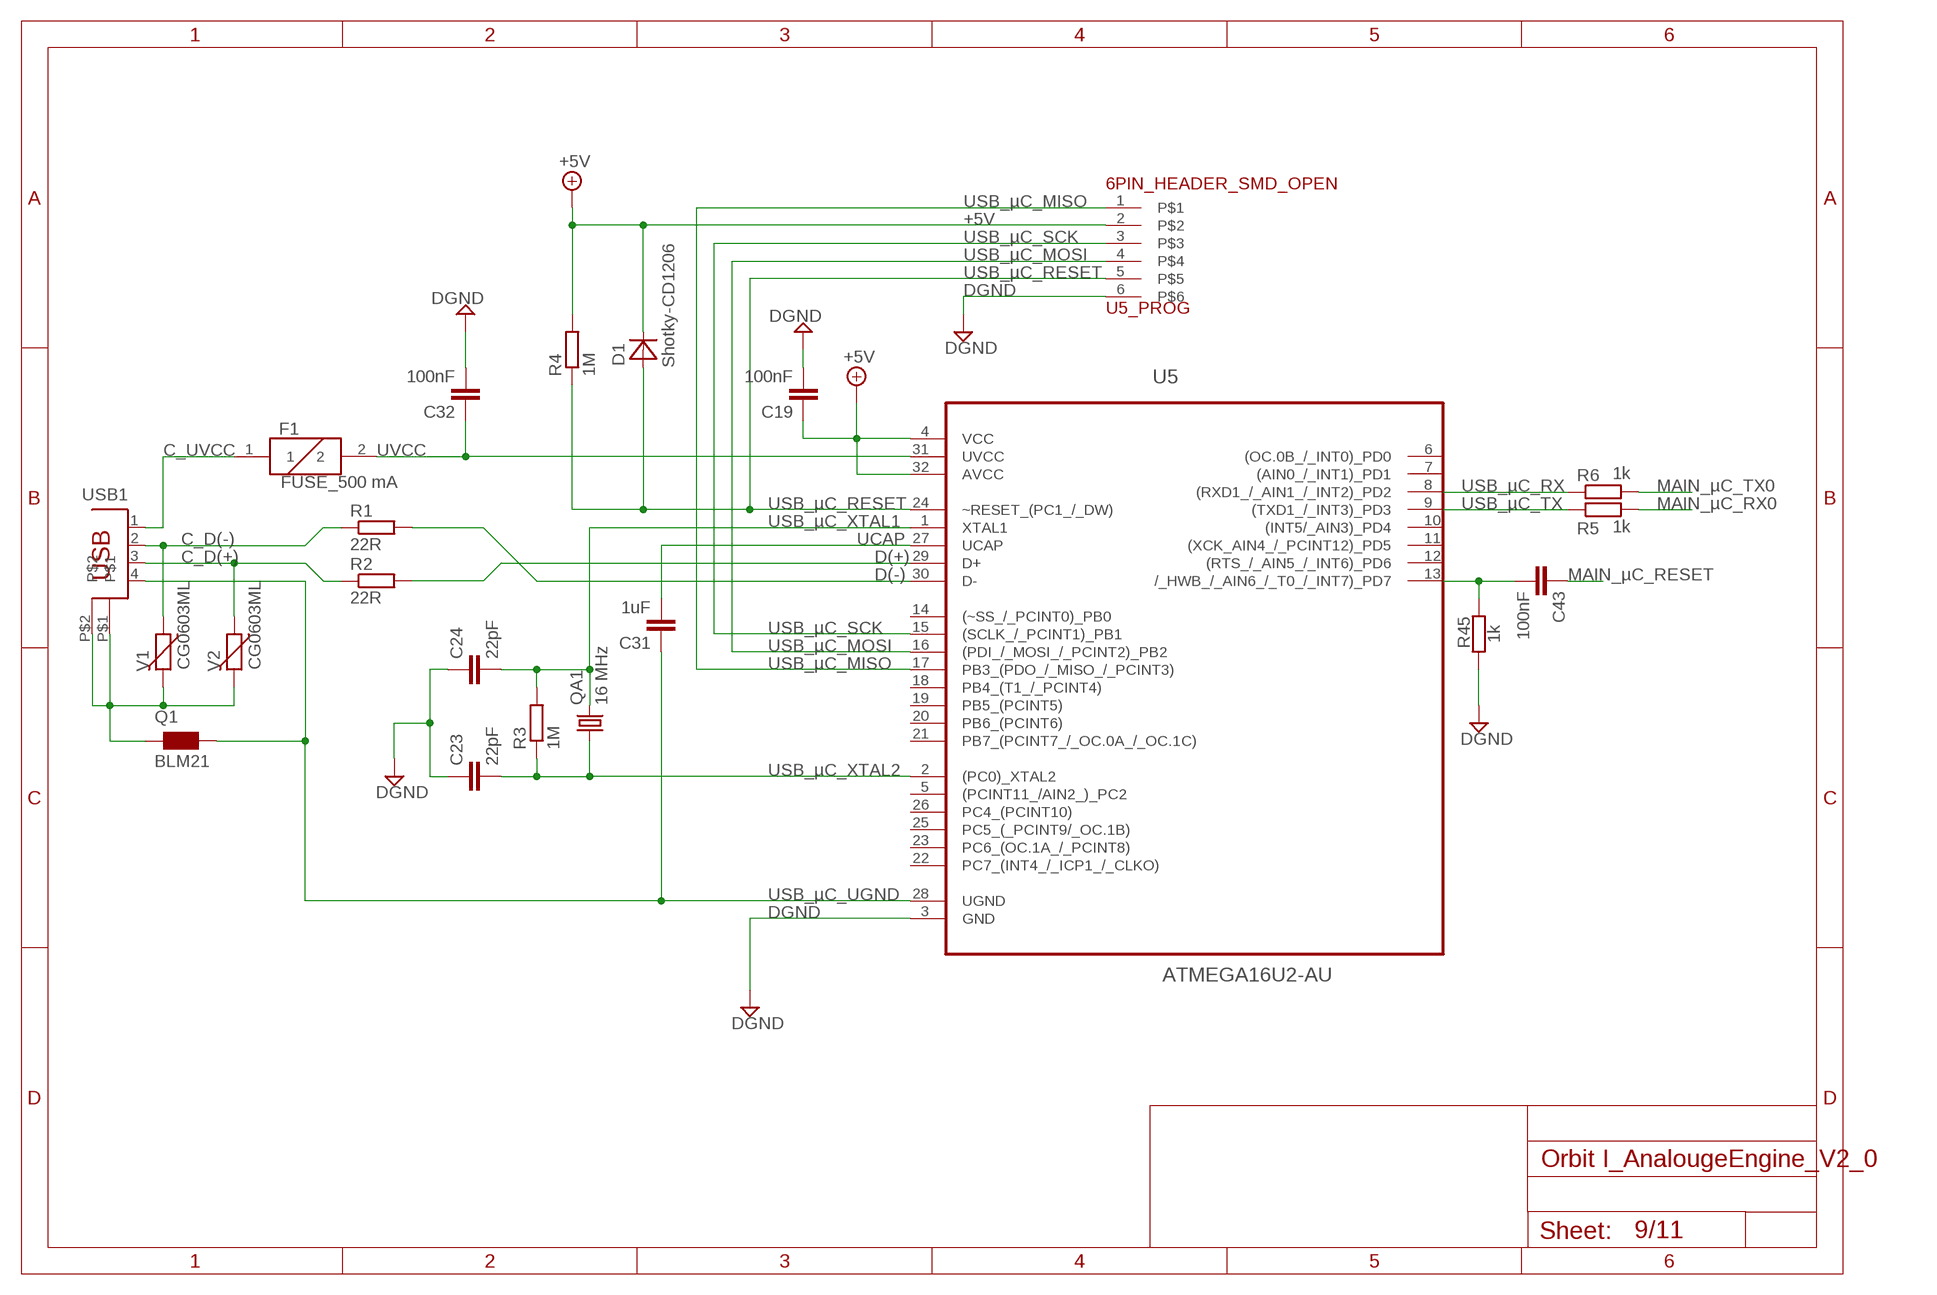
[diagram p8: schematic, sheet 9]

### Parts
C19  100nF  CAPACITOR"  [C0603]
C23  22pF  CAPACITOR"  [C0603]
C24  22pF  CAPACITOR"  [C0603]
C31  1uF  CAPACITOR"  [C0603]
C32  100nF  CAPACITOR"  [C0603]
C43  100nF  CAPACITOR"  [C0603]
D1  Shotky-CD1206  4148  [SOD323-R]
F1  FUSE_500 mA  RESTABLE_FUSE  [RESETABLE-FUSE]
Q1  BLM21  FERITEFERITE  [RESC2012X85]
QA1  16 MHz  CRYSTAL_SM49  [SM49]
R1  22R  RESISTOR"  [R0805]
R2  22R  RESISTOR"  [R0805]
R3  1M  RESISTOR"  [R0805]
R4  1M  RESISTOR"  [R0805]
R5  1k  RESISTOR"  [R0805]
R6  1k  RESISTOR"  [R0805]
R45  1k  RESISTOR"  [R0805]
U5  ATMEGA16U2-AU  [QFP80P900X900X120-32N]
U5_PROG  6PIN_HEADER_SMD_OPEN  [6PIN_HEADER_SMD_OPEN]
USB1  SMARTPRJ_PN61729  [SMARTPRJ_PN61729]
V1  CG0603ML  VARISTORVAR-0603  [VARC2513X70]
V2  CG0603ML  VARISTORVAR-0603  [VARC2513X70]

### Nets
+5V: C19.1 D1.C R4.2 U5.4(VCC) U5.32(AVCC) U5_PROG.2 ; also sheet 1,2,8,10
C_D(+): R2.1 USB1.3 V2.1
C_D(-): R1.1 USB1.2 V1.1
C_UVCC: F1.1 USB1.1
D(+): R2.2 U5.29(D+)
D(-): R1.2 U5.30(D-)
DGND: C19.2 C23.1 C24.1 C32.2 R45.1 U5.3(GND) U5_PROG.6 ; also sheet 1,2,8,10
MAIN_µC_RESET: C43.1 ; also sheet 10
MAIN_µC_RX0: R5.2 ; also sheet 10
MAIN_µC_TX0: R6.2 ; also sheet 10
N$34: Q1.1 USB1.P$1 USB1.P$2 V1.2 V2.2
N$74: C43.2 R45.2 U5.13(/_HWB_/_AIN6_/_T0_/_INT7)_PD7)
UCAP: C31.2 U5.27(UCAP)
USB_µC_MISO: U5.17(PB3_(PDO_/_MISO_/_PCINT3)) U5_PROG.1
USB_µC_MOSI: U5.16((PDI_/_MOSI_/_PCINT2)_PB2) U5_PROG.4
USB_µC_RESET: D1.A R4.1 U5.24(~RESET_(PC1_/_DW)) U5_PROG.5
USB_µC_RX: R6.1 U5.8((RXD1_/_AIN1_/_INT2)_PD2)
USB_µC_SCK: U5.15((SCLK_/_PCINT1)_PB1) U5_PROG.3
USB_µC_TX: R5.1 U5.9((TXD1_/_INT3)_PD3)
USB_µC_UGND: C31.1 Q1.2 U5.28(UGND) USB1.4
USB_µC_XTAL1: C24.2 QA1.2 R3.2 U5.1(XTAL1)
USB_µC_XTAL2: C23.2 QA1.1 R3.1 U5.2((PC0)_XTAL2)
UVCC: C32.1 F1.2 U5.31(UVCC)
Unconnected: U5.5((PCINT11_/AIN2_)_PC2) U5.6((OC.0B_/_INT0)_PD0) U5.7((AIN0_/_INT1)_PD1) U5.10((INT5/_AIN3)_PD4) U5.11((XCK_AIN4_/_PCINT12)_PD5) U5.12((RTS_/_AIN5_/_INT6)_PD6) U5.14((~SS_/_PCINT0)_PB0) U5.18(PB4_(T1_/_PCINT4)) U5.19(PB5_(PCINT5)) U5.20(PB6_(PCINT6)) U5.21(PB7_(PCINT7_/_OC.0A_/_OC.1C)) U5.22(PC7_(INT4_/_ICP1_/_CLKO)) U5.23(PC6_(OC.1A_/_PCINT8)) U5.25(PC5_(_PCINT9/_OC.1B)) U5.26(PC4_(PCINT10))

## Sheet 10 of 11: Main Controller
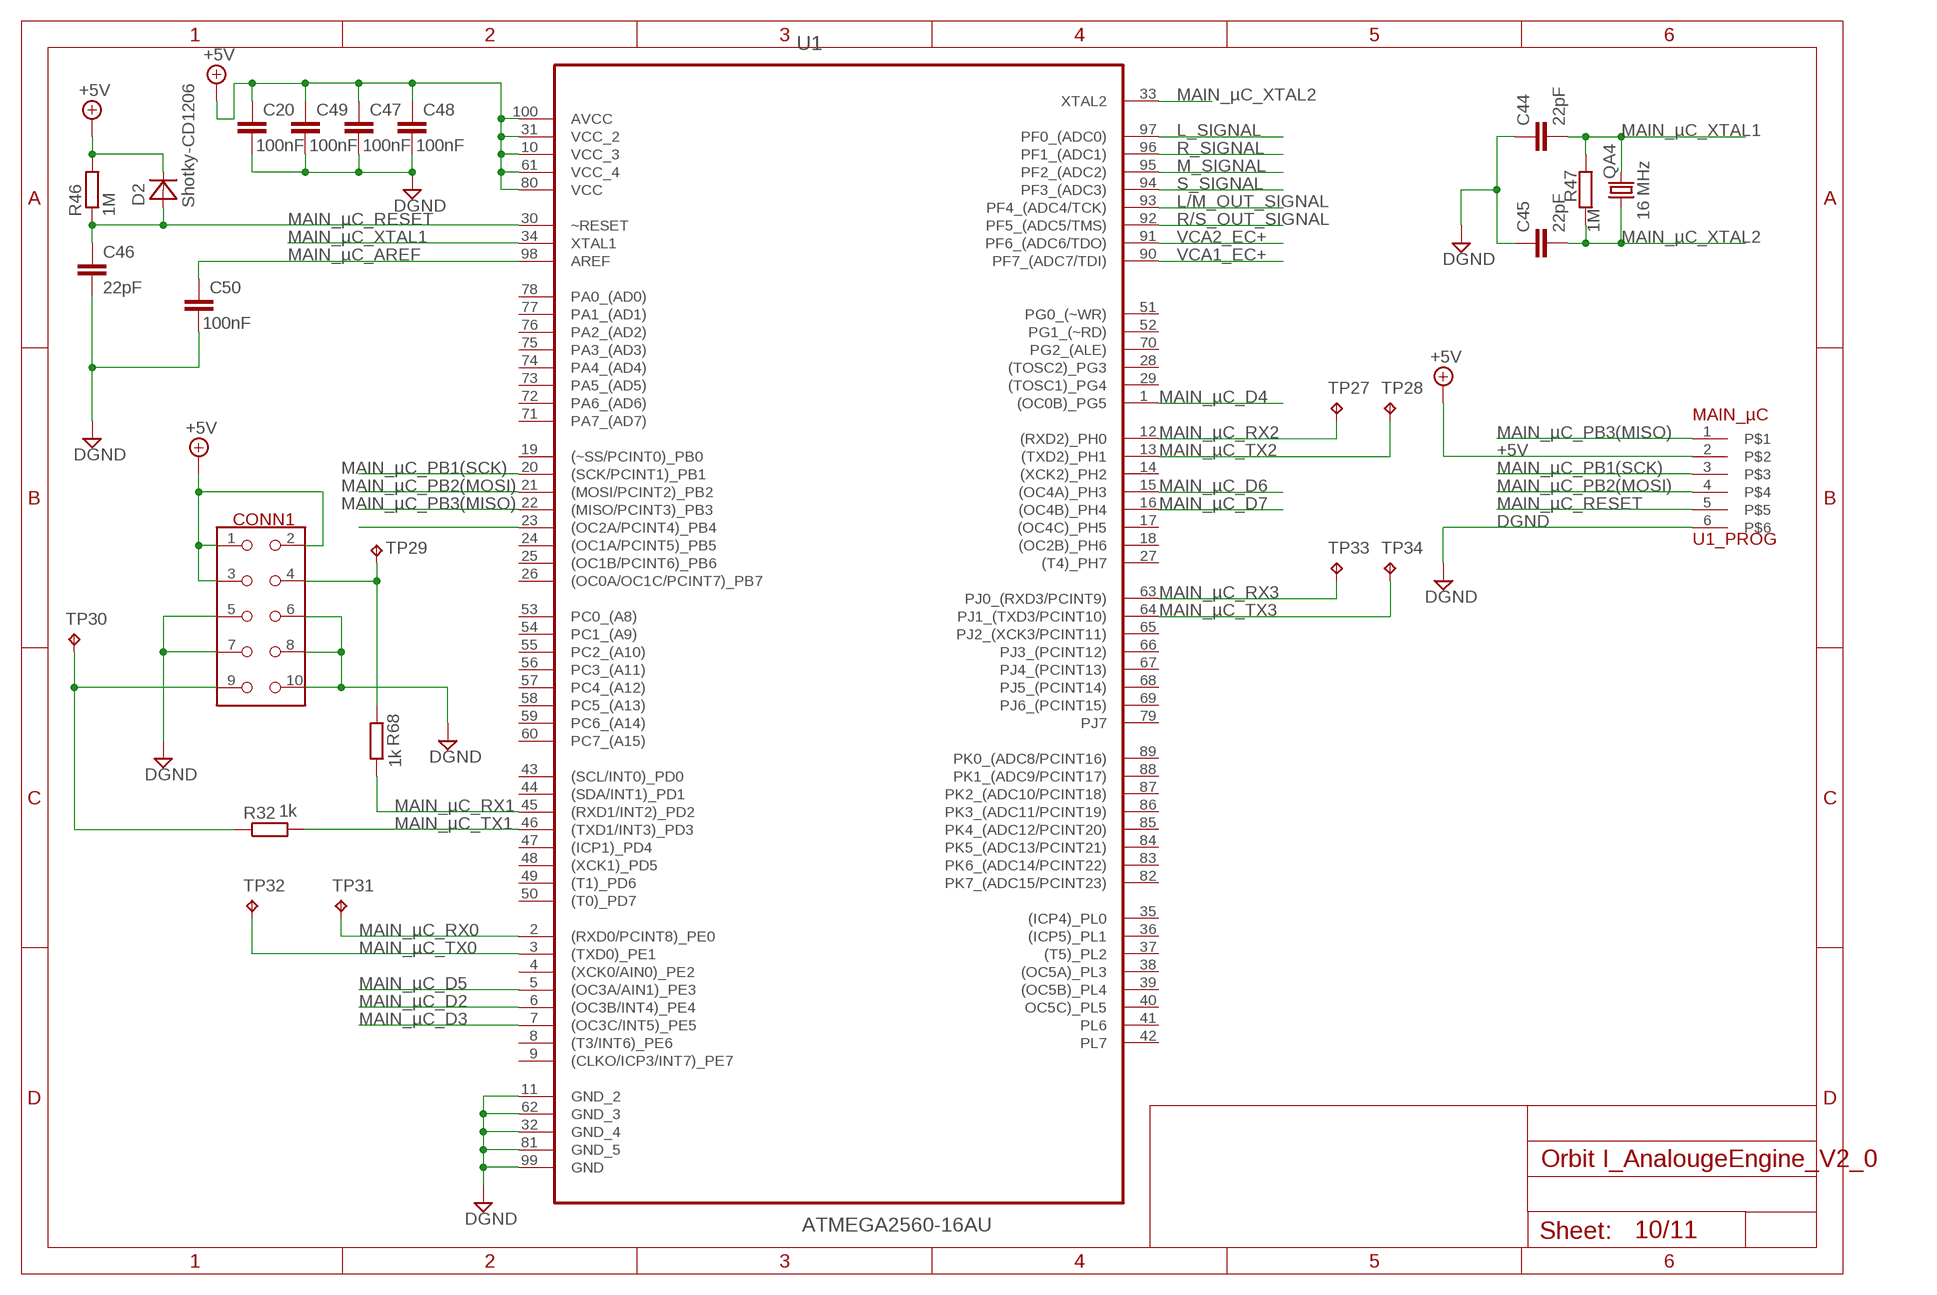
[diagram p9: schematic, sheet 10]

### Parts
C20  100nF  CAPACITOR"  [C0603]
C44  22pF  CAPACITOR"  [C0603]
C45  22pF  CAPACITOR"  [C0603]
C46  22pF  CAPACITOR"  [C0603]
C47  100nF  CAPACITOR"  [C0603]
C48  100nF  CAPACITOR"  [C0603]
C49  100nF  CAPACITOR"  [C0603]
C50  100nF  CAPACITOR"  [C0603]
CONN1  10PIN_HEADER_SMD  [87832-10]
D2  Shotky-CD1206  4148  [SOD323-R]
QA4  16 MHz  CRYSTAL_SM49  [SM49]
R32  1k  RESISTOR"  [R0805]
R46  1M  RESISTOR"  [R0805]
R47  1M  RESISTOR"  [R0805]
R68  1k  RESISTOR"  [R0805]
TP27  TPTHT  [THT_PIN]
TP28  TPTHT  [THT_PIN]
TP29  TPTHT  [THT_PIN]
TP30  TPTHT  [THT_PIN]
TP31  TPTHT  [THT_PIN]
TP32  TPTHT  [THT_PIN]
TP33  TPTHT  [THT_PIN]
TP34  TPTHT  [THT_PIN]
U1  ATMEGA2560-16AU  [QFP50P1600X1600X120-100N]
U1_PROG  MAIN_µC  6PIN_HEADER_SMD_OPEN  [6PIN_HEADER_SMD_OPEN]

### Nets
+5V: C20.1 C47.1 C48.1 C49.1 CONN1.1 CONN1.2 CONN1.3 D2.C R46.2 U1.10(VCC_3) U1.31(VCC_2) U1.61(VCC_4) U1.80(VCC) U1.100(AVCC) U1_PROG.2 ; also sheet 1,2,8,9
DGND: C20.2 C44.1 C45.1 C46.2 C47.2 C48.2 C49.2 C50.2 CONN1.5 CONN1.6 CONN1.7 CONN1.8 CONN1.10 U1.11(GND_2) U1.32(GND_4) U1.62(GND_3) U1.81(GND_5) U1.99(GND) U1_PROG.6 ; also sheet 1,2,8,9
L/M_OUT_SIGNAL: U1.93(PF4_(ADC4/TCK)) ; also sheet 8,11
L_SIGNAL: U1.97(PF0_(ADC0)) ; also sheet 8,11
M_SIGNAL: U1.95(PF2_(ADC2)) ; also sheet 8,11
MAIN_µC_AREF: C50.1 U1.98(AREF)
MAIN_µC_D2: U1.6((OC3B/INT4)_PE4) ; also sheet 2
MAIN_µC_D3: U1.7((OC3C/INT5)_PE5) ; also sheet 2
MAIN_µC_D4: U1.1((OC0B)_PG5) ; also sheet 2
MAIN_µC_D5: U1.5((OC3A/AIN1)_PE3) ; also sheet 2
MAIN_µC_D6: U1.15((OC4A)_PH3) ; also sheet 2
MAIN_µC_D7: U1.16((OC4B)_PH4) ; also sheet 2
MAIN_µC_PB1(SCK): U1.20((SCK/PCINT1)_PB1) U1_PROG.3
MAIN_µC_PB2(MOSI): U1.21((MOSI/PCINT2)_PB2) U1_PROG.4
MAIN_µC_PB3(MISO): U1.22((MISO/PCINT3)_PB3) U1_PROG.1
MAIN_µC_RESET: C46.1 D2.A R46.1 U1.30(~RESET) U1_PROG.5 ; also sheet 9
MAIN_µC_RX0: TP31.P$1(TP) U1.2((RXD0/PCINT8)_PE0) ; also sheet 9
MAIN_µC_RX1: R68.2 U1.45((RXD1/INT2)_PD2)
MAIN_µC_RX2: TP27.P$1(TP) U1.12((RXD2)_PH0) ; also sheet 8
MAIN_µC_RX3: TP33.P$1(TP) U1.63(PJ0_(RXD3/PCINT9)) ; also sheet 8
MAIN_µC_TX0: TP32.P$1(TP) U1.3((TXD0)_PE1) ; also sheet 9
MAIN_µC_TX1: R32.2 U1.46((TXD1/INT3)_PD3)
MAIN_µC_TX2: TP28.P$1(TP) U1.13((TXD2)_PH1) ; also sheet 8
MAIN_µC_TX3: TP34.P$1(TP) U1.64(PJ1_(TXD3/PCINT10)) ; also sheet 8
MAIN_µC_XTAL1: C44.2 QA4.2 R47.2 U1.34(XTAL1)
MAIN_µC_XTAL2: C45.2 QA4.1 R47.1 U1.33(XTAL2)
N$6: CONN1.4 R68.1 TP29.P$1(TP)
N$9: CONN1.9 R32.1 TP30.P$1(TP)
N$12: U1.23((OC2A/PCINT4)_PB4)
R/S_OUT_SIGNAL: U1.92(PF5_(ADC5/TMS)) ; also sheet 8,11
R_SIGNAL: U1.96(PF1_(ADC1)) ; also sheet 8,11
S_SIGNAL: U1.94(PF3_(ADC3)) ; also sheet 8,11
VCA1_EC+: U1.90(PF7_(ADC7/TDI)) ; also sheet 6
VCA2_EC+: U1.91(PF6_(ADC6/TDO)) ; also sheet 6
Unconnected: U1.4((XCK0/AIN0)_PE2) U1.8((T3/INT6)_PE6) U1.9((CLKO/ICP3/INT7)_PE7) U1.14((XCK2)_PH2) U1.17((OC4C)_PH5) U1.18((OC2B)_PH6) U1.19((~SS/PCINT0)_PB0) U1.24((OC1A/PCINT5)_PB5) U1.25((OC1B/PCINT6)_PB6) U1.26((OC0A/OC1C/PCINT7)_PB7) U1.27((T4)_PH7) U1.28((TOSC2)_PG3) U1.29((TOSC1)_PG4) U1.35((ICP4)_PL0) U1.36((ICP5)_PL1) U1.37((T5)_PL2) U1.38((OC5A)_PL3) U1.39((OC5B)_PL4) U1.40(OC5C)_PL5) U1.41(PL6) U1.42(PL7) U1.43((SCL/INT0)_PD0) U1.44((SDA/INT1)_PD1) U1.47((ICP1)_PD4) U1.48((XCK1)_PD5) U1.49((T1)_PD6) U1.50((T0)_PD7) U1.51(PG0_(~WR)) U1.52(PG1_(~RD)) U1.53(PC0_(A8)) U1.54(PC1_(A9)) U1.55(PC2_(A10)) U1.56(PC3_(A11)) U1.57(PC4_(A12)) U1.58(PC5_(A13)) U1.59(PC6_(A14)) U1.60(PC7_(A15)) U1.65(PJ2_(XCK3/PCINT11)) U1.66(PJ3_(PCINT12)) U1.67(PJ4_(PCINT13)) U1.68(PJ5_(PCINT14)) U1.69(PJ6_(PCINT15)) U1.70(PG2_(ALE)) U1.71(PA7_(AD7)) U1.72(PA6_(AD6)) U1.73(PA5_(AD5)) U1.74(PA4_(AD4)) U1.75(PA3_(AD3)) U1.76(PA2_(AD2)) U1.77(PA1_(AD1)) U1.78(PA0_(AD0)) U1.79(PJ7) U1.82(PK7_(ADC15/PCINT23)) U1.83(PK6_(ADC14/PCINT22)) U1.84(PK5_(ADC13/PCINT21)) U1.85(PK4_(ADC12/PCINT20)) U1.86(PK3_(ADC11/PCINT19)) U1.87(PK2_(ADC10/PCINT18)) U1.88(PK1_(ADC9/PCINT17)) U1.89(PK0_(ADC8/PCINT16))

## Sheet 11 of 11: Signal Rectifiers
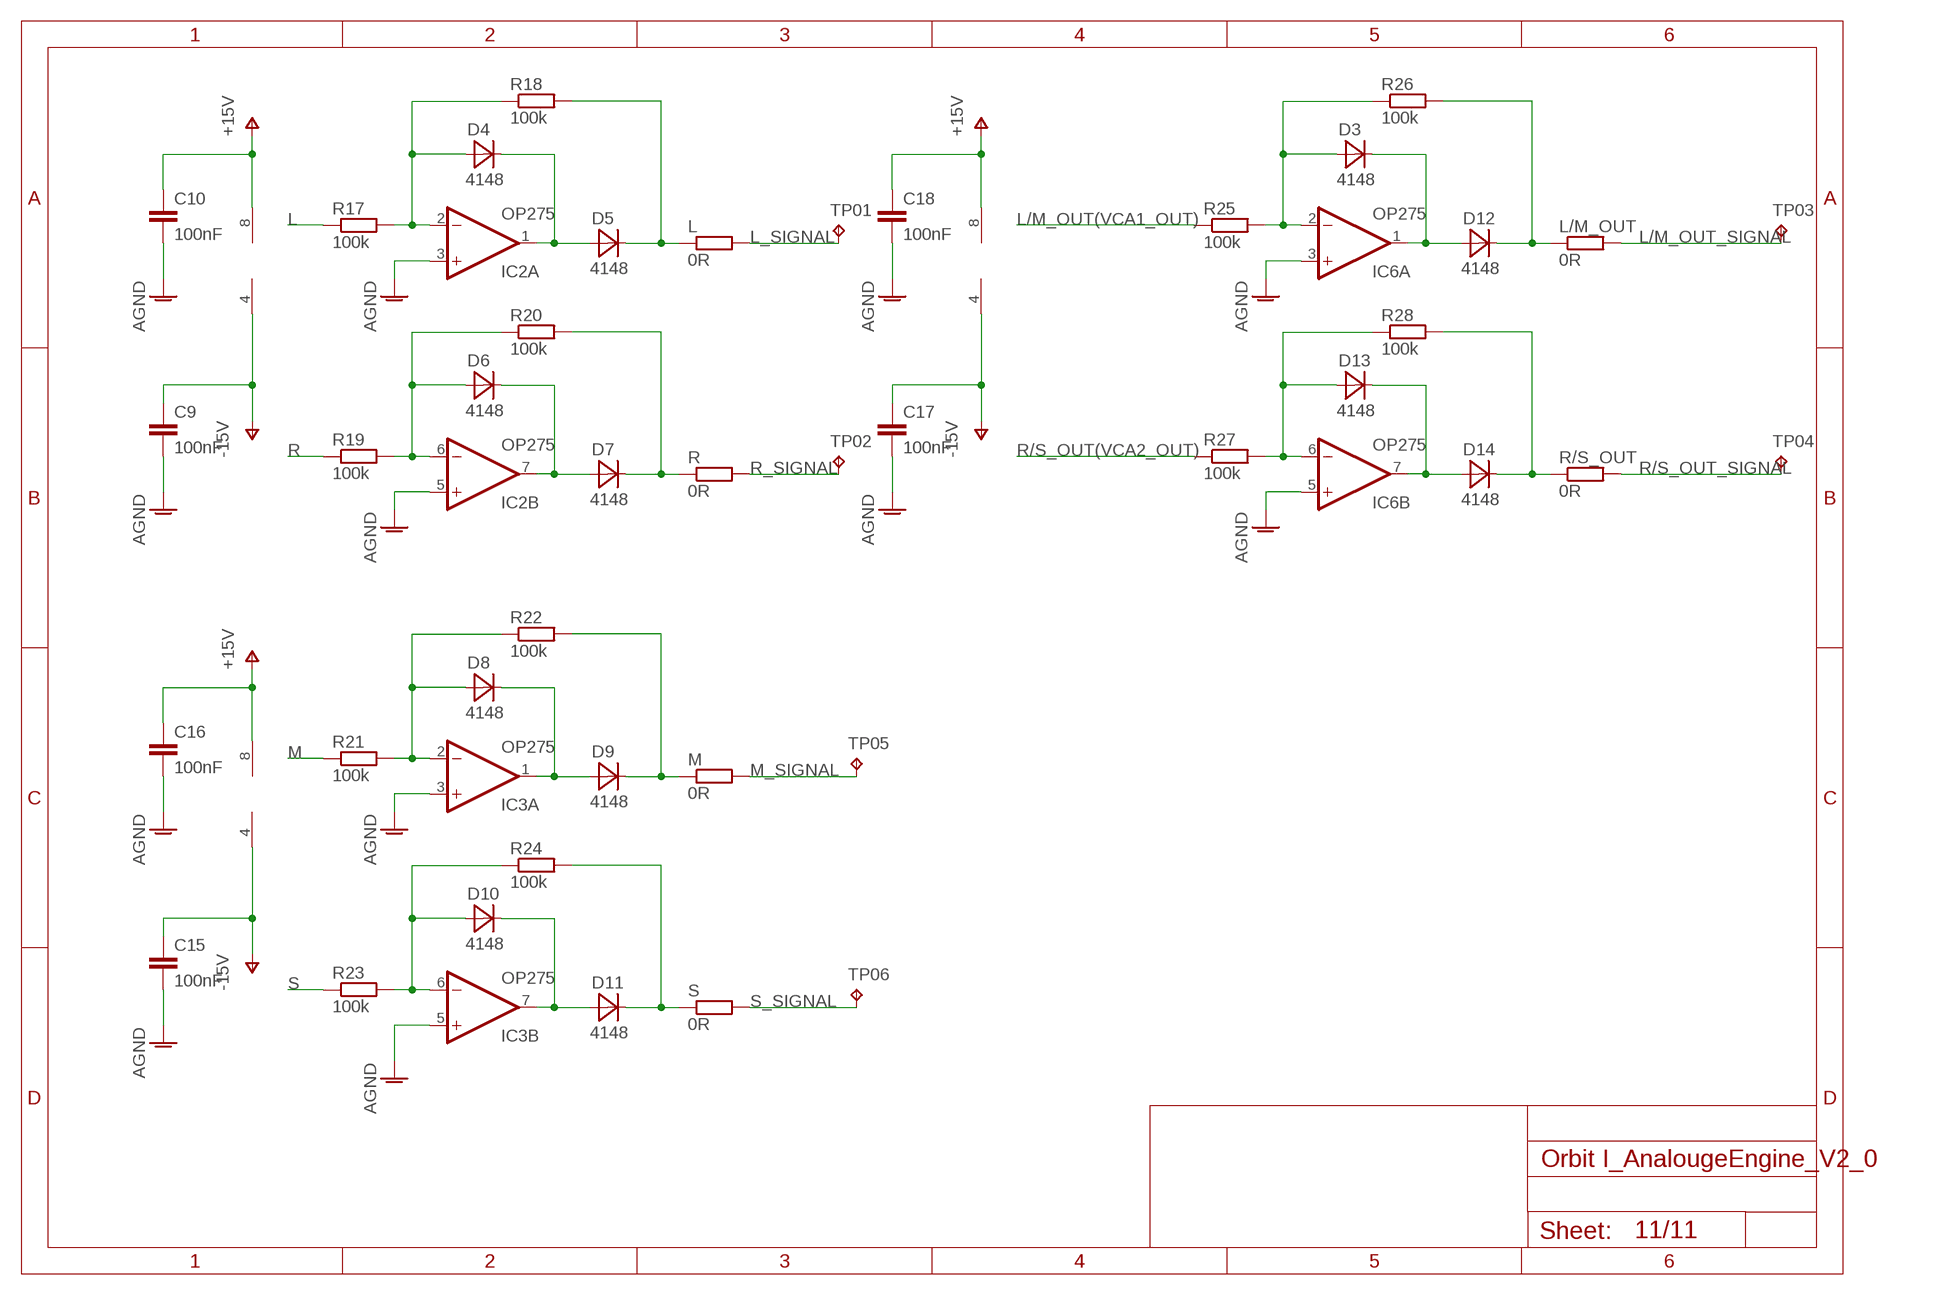
[diagram p10: schematic, sheet 11]

### Parts
C9  100nF  CAPACITOR"  [C0603]
C10  100nF  CAPACITOR"  [C0603]
C15  100nF  CAPACITOR"  [C0603]
C16  100nF  CAPACITOR"  [C0603]
C17  100nF  CAPACITOR"  [C0603]
C18  100nF  CAPACITOR"  [C0603]
D3  4148  [SOD323-R]
D4  4148  [SOD323-R]
D5  4148  [SOD323-R]
D6  4148  [SOD323-R]
D7  4148  [SOD323-R]
D8  4148  [SOD323-R]
D9  4148  [SOD323-R]
D10  4148  [SOD323-R]
D11  4148  [SOD323-R]
D12  4148  [SOD323-R]
D13  4148  [SOD323-R]
D14  4148  [SOD323-R]
IC2  OP275  [SOIC8]
IC3  OP275  [SOIC8]
IC6  OP275  [SOIC8]
L  0R  RESISTOR"  [R0805]
L/M_OUT  0R  RESISTOR"  [R0805]
M  0R  RESISTOR"  [R0805]
R  0R  RESISTOR"  [R0805]
R17  100k  RESISTOR"  [R0805]
R18  100k  RESISTOR"  [R0805]
R19  100k  RESISTOR"  [R0805]
R20  100k  RESISTOR"  [R0805]
R21  100k  RESISTOR"  [R0805]
R22  100k  RESISTOR"  [R0805]
R23  100k  RESISTOR"  [R0805]
R24  100k  RESISTOR"  [R0805]
R25  100k  RESISTOR"  [R0805]
R26  100k  RESISTOR"  [R0805]
R27  100k  RESISTOR"  [R0805]
R28  100k  RESISTOR"  [R0805]
R/S_OUT  0R  RESISTOR"  [R0805]
S  0R  RESISTOR"  [R0805]
TP01  TPTHT  [THT_PIN]
TP02  TPTHT  [THT_PIN]
TP03  TPTHT  [THT_PIN]
TP04  TPTHT  [THT_PIN]
TP05  TPTHT  [THT_PIN]
TP06  TPTHT  [THT_PIN]

### Nets
AGND: C9.2 C10.2 C15.2 C16.2 C17.2 C18.2 IC2.3(A:+IN) IC2.5(B:+IN) IC3.3(A:+IN) IC3.5(B:+IN) IC6.3(A:+IN) IC6.5(B:+IN) ; also sheet 1,3,4,5,6,7,8
L: R17.1 ; also sheet 4,5
L/M_OUT(VCA1_OUT): R25.1 ; also sheet 6,7
L/M_OUT_SIGNAL: L/M_OUT.2 TP03.P$1(TP) ; also sheet 8,10
L_SIGNAL: L.2 TP01.P$1(TP) ; also sheet 8,10
M: R21.1 ; also sheet 5
M_SIGNAL: M.2 TP05.P$1(TP) ; also sheet 8,10
N$20: D5.C L.1 R18.2
N$38: D4.A IC2.2(A:-IN) R17.2 R18.1
N$39: D4.C D5.A IC2.1(A:OUT)
N$40: D6.A IC2.6(B:-IN) R19.2 R20.1
N$41: D6.C D7.A IC2.7(B:OUT)
N$42: D7.C R20.2 R.1
N$44: D8.A IC3.2(A:-IN) R21.2 R22.1
N$46: D8.C D9.A IC3.1(A:OUT)
N$47: D9.C M.1 R22.2
N$48: D10.A IC3.6(B:-IN) R23.2 R24.1
N$49: D10.C D11.A IC3.7(B:OUT)
N$50: D11.C R24.2 S.1
N$51: D3.A IC6.2(A:-IN) R25.2 R26.1
N$52: D3.C D12.A IC6.1(A:OUT)
N$53: D12.C L/M_OUT.1 R26.2
N$54: D13.A IC6.6(B:-IN) R27.2 R28.1
N$55: D13.C D14.A IC6.7(B:OUT)
N$56: D14.C R28.2 R/S_OUT.1
R: R19.1 ; also sheet 3,5
R/S_OUT(VCA2_OUT): R27.1 ; also sheet 6,7
R/S_OUT_SIGNAL: R/S_OUT.2 TP04.P$1(TP) ; also sheet 8,10
R_SIGNAL: R.2 TP02.P$1(TP) ; also sheet 8,10
S: R23.1 ; also sheet 5
S_SIGNAL: S.2 TP06.P$1(TP) ; also sheet 8,10
V+: C10.1 C16.1 C18.1 IC2.8(P:V+) IC3.8(P:V+) IC6.8(P:V+) ; supply symbol labelled +15V ; also sheet 1,3,4,5,6,7,8
V-: C9.1 C15.1 C17.1 IC2.4(P:V-) IC3.4(P:V-) IC6.4(P:V-) ; supply symbol labelled -15V ; also sheet 1,3,4,5,6,7

## Library data of the parts
BY_1_1 BY_1_2 BY_2_1 BY_2_2 K5-K8 = C_Sager_Bibliothek:RELAY_EE2-5NU: RELAY SPST; DGIKEY: 399-11056-5-ND; MF: KEMET; MPN: EE2-5NU; OC_NEWARK: unknown
C1-C35 C37-C40 C42-C66 = C_Sager_Bibliothek:CAPACITOR: capacitor
C36 C41 C67-C70 = C_Sager_Bibliothek:SMD_ELCTROLYTIC: SMD Elektrolyt Kondensator 153CLV-0605
CONN1 = C_Sager_Bibliothek:10PIN_HEADER_SMD: 10 Pin Header (Flachbandkabel)
CONN2 CONN3 = C_Sager_Bibliothek:SCHRAUBKLEMME_3POL: WAGO SCREW CLAMP; MPN: 237-103; OC_FARNELL: unknown; OC_NEWARK: 18M7116
D1-D14 = C_Sager_Bibliothek:4148: Standard 4148 Diode SOD323 Format
DAC1 DAC2 = SPI:MCP4922: MCP4922 Digital Analog Converter
DGND1-DGND4 TP01-TP09 TP10-TP37 = C_Sager_Bibliothek:TP
F1 = C_Sager_Bibliothek:RESTABLE_FUSE
IC1-IC4 IC6 IC8 = C_Sager_Bibliothek:OP275: Dual Very Low Noise Precision Operational Amplifier Source: http://www.analog.com/static/imported-files/data_sheets/OP270.pdf
IC9 = C_Sager_Bibliothek:TL072
IN1(R/S) IN2(L/M) = C_Sager_Bibliothek:NEUTRIK_NC3FAH
IN_LEFT IN_RIGHT U4 U6-U8 = THAT_Library:THAT1240: Balanced Line Receiver THAT1240, THAT1243, THAT1246
L L/M_OUT M R R1-R68 R/S_OUT S = C_Sager_Bibliothek:RESISTOR: +/- 5 % resistor
L1-L6 = C_Sager_Bibliothek:SMD_LED_0603: SMD LED 0603
OUT1(R/S) OUT2(L/M) = C_Sager_Bibliothek:NEUTRIK_NC3MAH
OUT_LEFT OUT_RIGHT = THAT_Library:THAT1646: Outsmarts Balanced Line Driver
Q1 = C_Sager_Bibliothek:FERITE
QA1-QA4 = C_Sager_Bibliothek:CRYSTAL_SM49: Quarz in SM49
U1 = C_Sager_Bibliothek:ATMEGA2560-16AU: Microcontroller; DESCRIPTION: Microcontroller; MPN: ATMEGA2560-16AU
U1_PROG U5_PROG U10_PROG U11_PROG = C_Sager_Bibliothek:6PIN_HEADER_SMD_OPEN: 6 Pin Header SMD
U5 = C_Sager_Bibliothek:ATMEGA16U2-AU: 8-bit Microcontroller; MPN: ATMEGA16U2-AU; OC_FARNELL: 1841607; OC_NEWARK: 12T1292; PACKAGE: QFP-32; SUPPLIER: Atmel
U10 U11 = C_Sager_Bibliothek:ATMEGA328P-AU: 8-bit Microcontroller with In-System Programmable Flash; DIGIKEY: ATMEGA328P-AU-ND; MPN: ATMEGA328P-AU; PACKAGE: TQFP-32
U12 = C_Sager_Bibliothek:ULN2003
UR1 = C_Sager_Bibliothek:78**
USB1 = C_Sager_Bibliothek:SMARTPRJ_PN61729: BERG USB connector
V1 V2 = C_Sager_Bibliothek:VARISTOR
VCA1(LEFT) VCA2(RIGHT) = THAT_Library:THAT2181: VCA Trimmable IC